# EAGLE design exia7th_v7 (EAGLE 9.6.2)
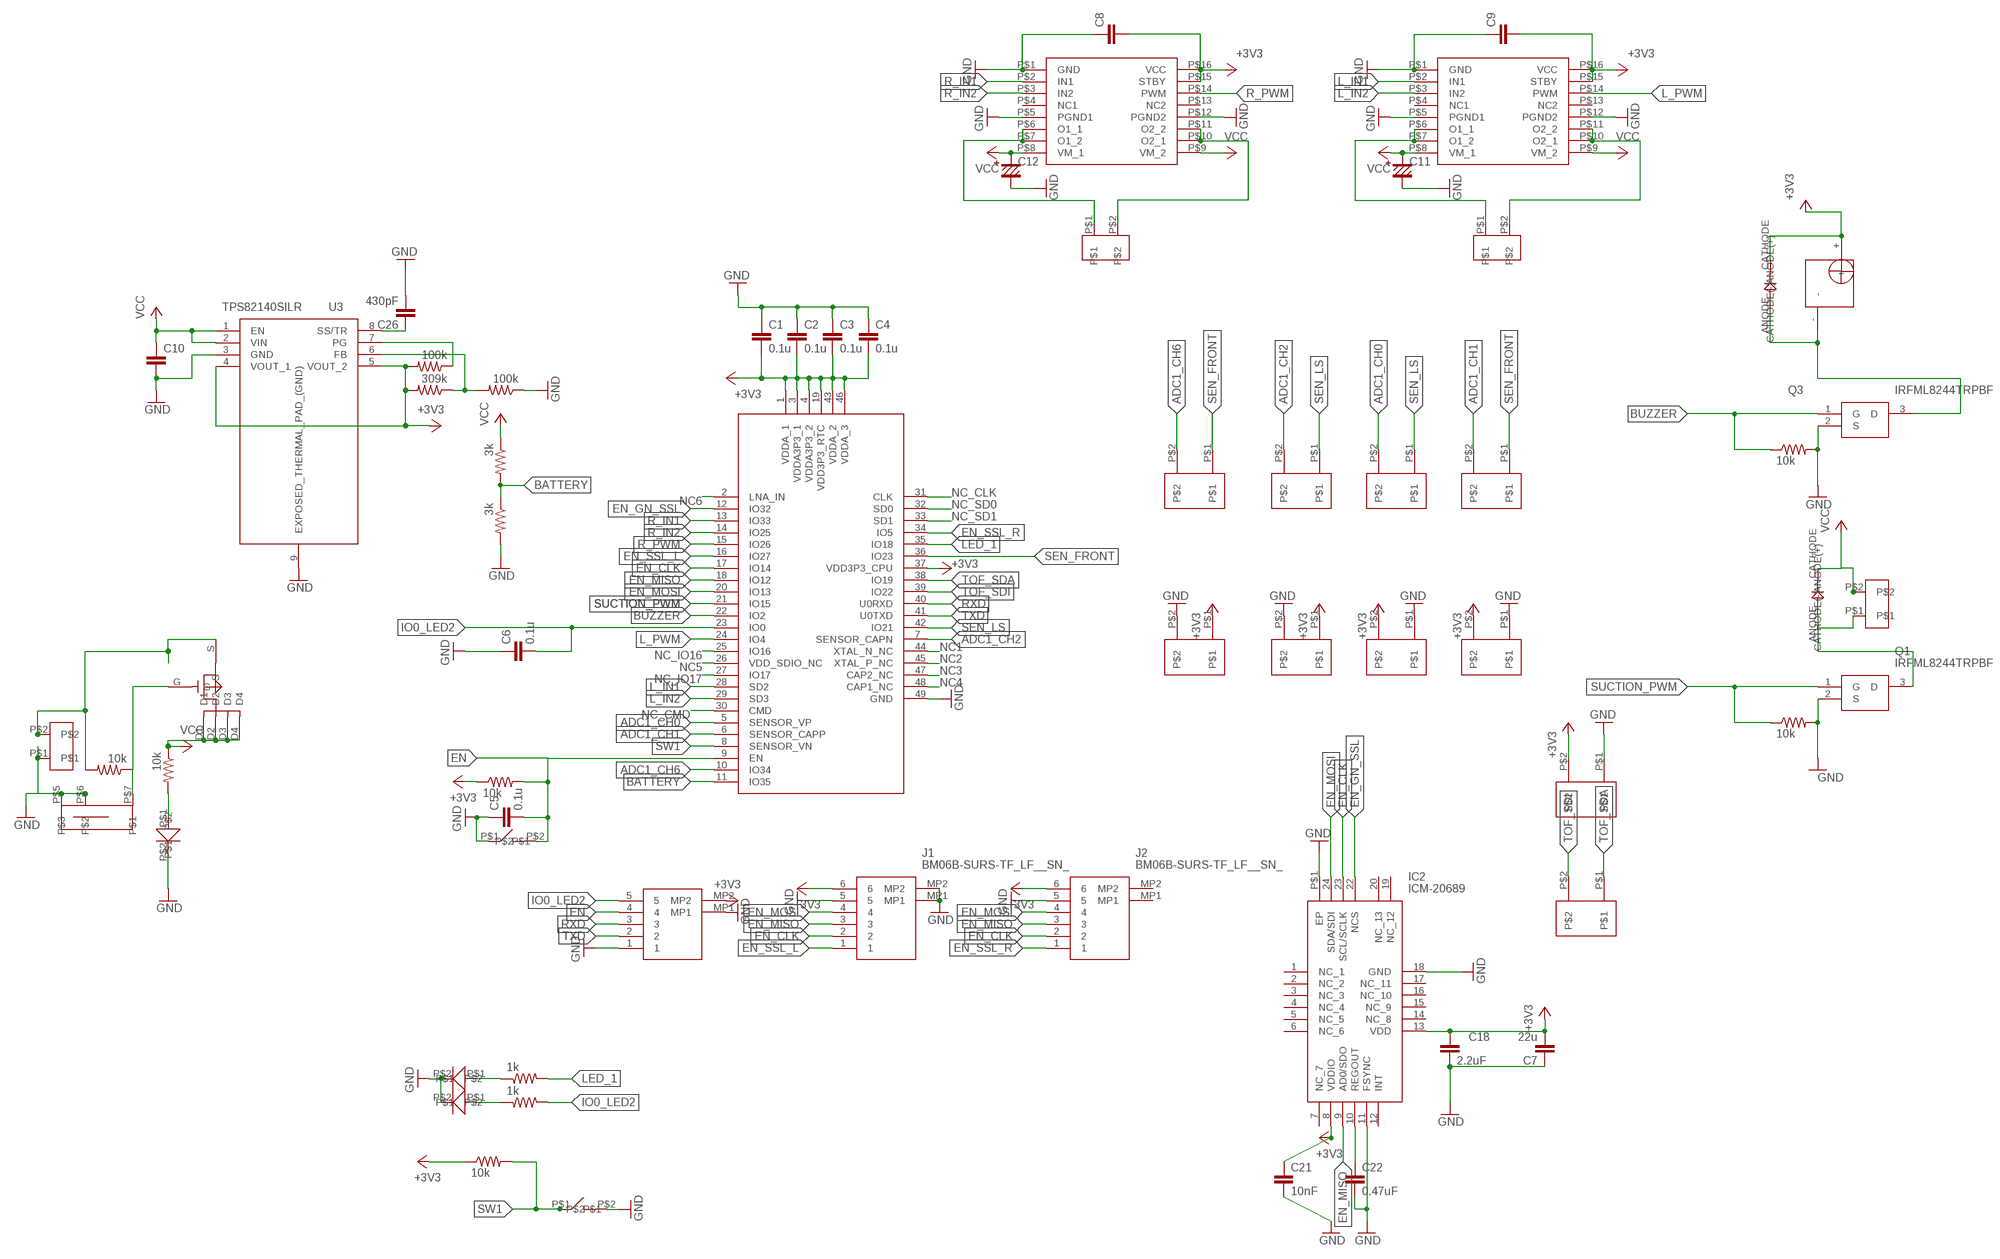
[diagram p0: schematic, sheet 1, part 1 of 2]
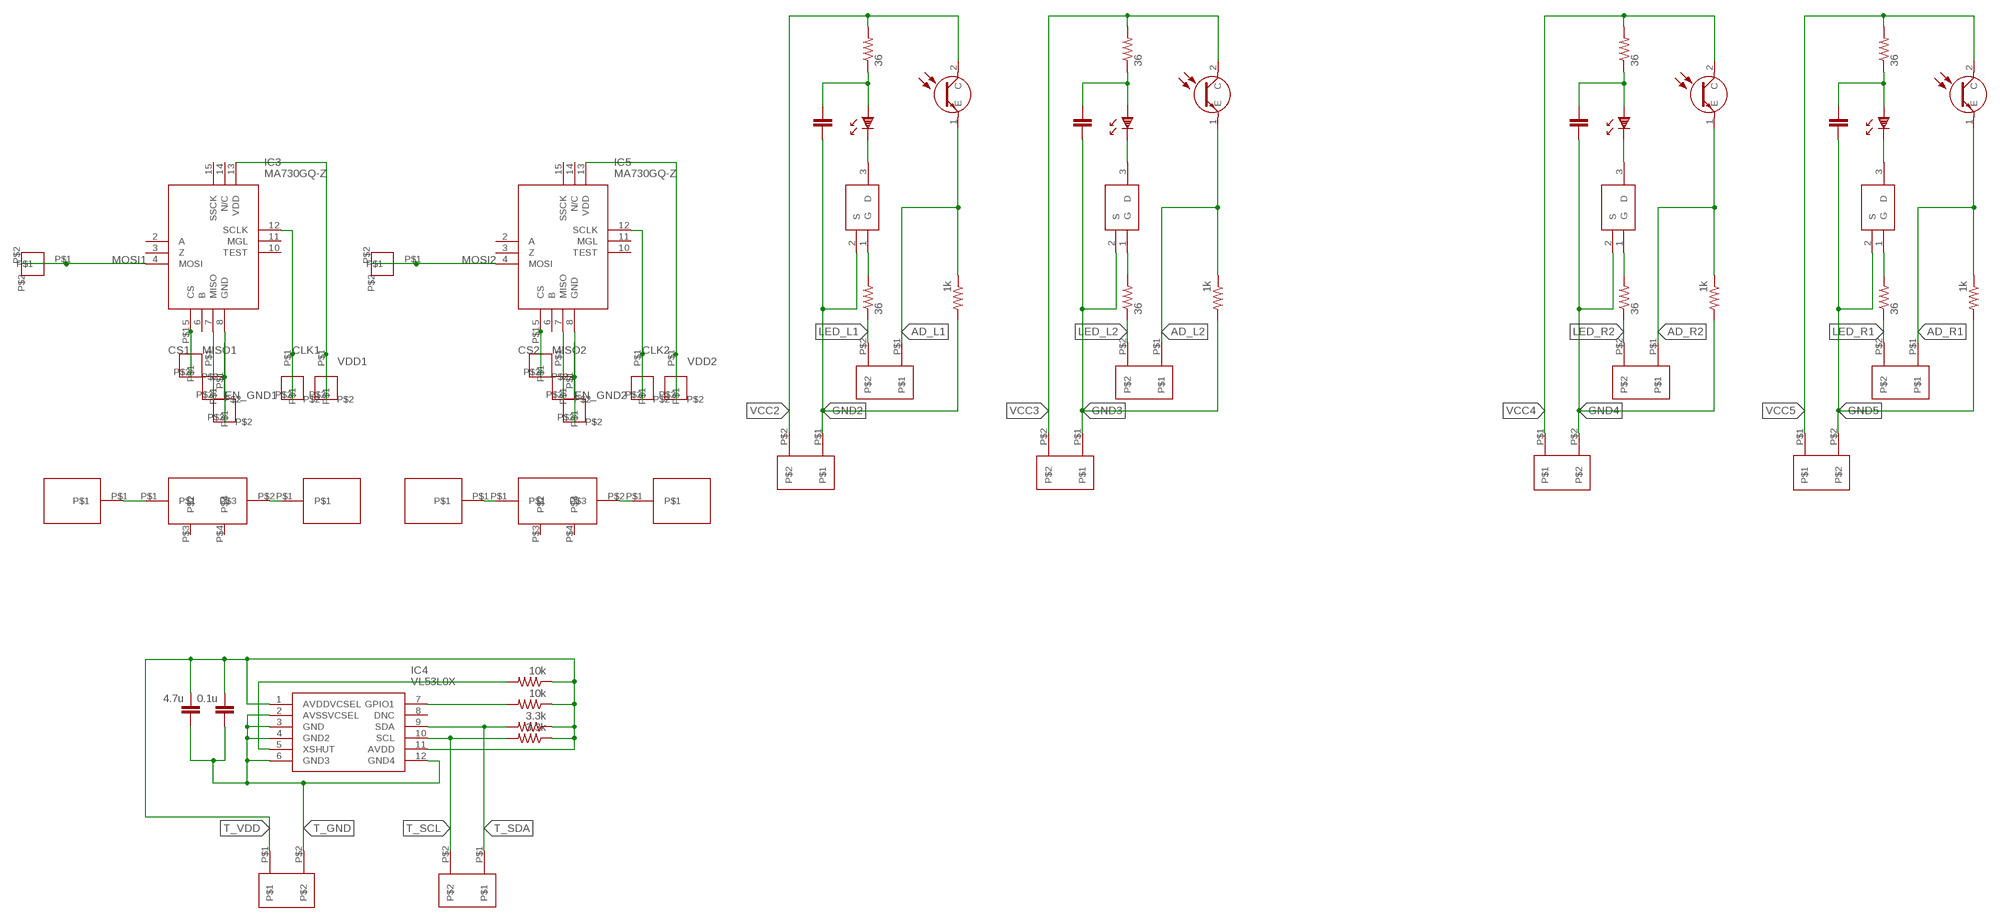
[diagram p1: schematic, sheet 1, part 2 of 2]

## Parts
C1  0.1u  C1005  [R1005]
C2  0.1u  C1005  [R1005]
C3  0.1u  C1005  [R1005]
C4  0.1u  C1005  [R1005]
C5  0.1u  C1005  [R1005]
C6  0.1u  C1005  [R1005]
C7  22u  C1608  [C1608]
C8  C1005  [R1005]
C9  C1005  [R1005]
C10  C1608  [C1608]
C11  EC1  [EC1]
C12  EC1  [EC1]
C13  C3216  [C3216]
C14  C3216  [C3216]
C15  C3216  [C3216]
C16  C3216  [C3216]
C17  0.1u  C1005  [R1005]
C18  2.2uF  C1005  [R1005]
C19  4.7u  C1005  [R1005]
C21  10nF  C1005  [R1005]
C22  0.47uF  C1005  [R1005]
C26  430pF  C1005  [R1005]
IC1  ESP32-PICO-D4  [ESP32-PICO-D4_1]
IC2  ICM-20689  [QFN50P400X400X95-25N]
IC3  MA730GQ-Z  [QFN50P300X300X100-17N]
IC4  VL53L0X  [VL53L0X]
IC5  MA730GQ-Z  [QFN50P300X300X100-17N]
J1  BM06B-SURS-TF_LF__SN_  [BM06BSURSTFLFSN]
J2  BM06B-SURS-TF_LF__SN_  [BM06BSURSTFLFSN]
J3  BM05B-SURS-TF  [BM05BSURSTF]
Q1  IRFML8244TRPBF  [SOT95P237X112-3N]
Q2  LTR-4206E  [LTR4206E]
Q3  IRFML8244TRPBF  [SOT95P237X112-3N]
Q4  IRFML8244TRPBF  [SOT95P237X112-3N]
Q5  LTR-4206E  [LTR4206E]
Q6  IRFML8244TRPBF  [SOT95P237X112-3N]
Q7  LTR-4206E  [LTR4206E]
Q8  IRFML8244TRPBF  [SOT95P237X112-3N]
Q9  LTR-4206E  [LTR4206E]
Q10  IRFML8244TRPBF  [SOT95P237X112-3N]
R1  10k  R1005  [R1005]
R2  3k  R1005  [R1005]
R3  3k  R1005  [R1005]
R4  10k  R1005  [R1005]
R5  36  R1005  [R1005]
R6  1k  R1005  [R1005]
R7  10k  R1005  [R1005]
R8  10k  R1005  [R1005]
R9  10k  R1005  [R1005]
R10  10k  R1005  [R1005]
R11  36  R1005  [R1005]
R12  36  R1005  [R1005]
R13  36  R1005  [R1005]
R14  1k  R1005  [R1005]
R15  36  R1005  [R1005]
R16  1k  R1005  [R1005]
R17  36  R1005  [R1005]
R18  36  R1005  [R1005]
R19  36  R1005  [R1005]
R20  3.3k  R1005  [R1005]
R21  3.3k  R1005  [R1005]
R22  10k  R1005  [R1005]
R23  1k  R1005  [R1005]
R24  1k  R1005  [R1005]
R25  100k  R1005  [R1005]
R26  10k  R1005  [R1005]
R28  309k  R1005  [R1005]
R36  100k  R1005  [R1005]
R54  1k  R1005  [R1005]
U3  TPS82140SILR  [SIL0008D]
U$1  TB6614  [TB6614]
U$2  LED_1005  [LED_1005]
U$3  CONNECTOR_15_2  [CONNECTOR_2]
U$4  DCX6  [DCX6]
U$5  SENSOR_FRONT1  [SENSOR_FRONT1]
U$6  SENSOR_FRONT1  [SENSOR_FRONT1]
U$7  SENSOR_FRONT1  [SENSOR_FRONT1]
U$8  SENSOR_FRONT1  [SENSOR_FRONT1]
U$9  SENSOR_FRONT1  [SENSOR_FRONT1]
U$10  SENSOR_FRONT1  [SENSOR_FRONT1]
U$11  SENSOR_FRONT1  [SENSOR_FRONT1]
U$12  DIODE  [DIODE]
U$13  BUZZER_44  [BUZZER]
U$14  CONNECTOR_15_2  [CONNECTOR_2]
U$15  DIODE  [DIODE]
U$16  DCX6  [DCX6]
U$17  CONNECTOR_15_2  [CONNECTOR_2]
U$18  CONNECTOR_15_2  [CONNECTOR_2]
U$19  TB6614  [TB6614]
U$20  SENSOR_FRONT1  [SENSOR_FRONT1]
U$21  SENSOR_FRONT1  [SENSOR_FRONT1]
U$22  TVAF06  [TVAF06]
U$23  SI3493  [MOS_FET_P]
U$24  ENCORDER_PAD  [ENCORDER_PAD]
U$25  LED_1005  [LED_1005]
U$26  LED_1005  [LED_1005]
U$27  ENCORDER_PAD  [ENCORDER_PAD]
U$28  ENCORDER_PAD  [ENCORDER_PAD]
U$29  ENCORDER_PAD  [ENCORDER_PAD]
U$30  ENCORDER_PAD  [ENCORDER_PAD]
U$31  ENCORDER_PAD  [ENCORDER_PAD]
U$32  SENSOR_FRONT1  [SENSOR_FRONT1]
U$33  SFH4550  [SFH_4550]
U$34  SENSOR_FRONT1  [SENSOR_FRONT1]
U$35  SENSOR_FRONT1  [SENSOR_FRONT1]
U$36  ENCORDER_PAD  [ENCORDER_PAD]
U$37  ENCORDER_PAD  [ENCORDER_PAD]
U$38  ENCORDER_PAD  [ENCORDER_PAD]
U$39  ENCORDER_PAD  [ENCORDER_PAD]
U$40  ENCORDER_PAD  [ENCORDER_PAD]
U$41  ENCORDER_PAD  [ENCORDER_PAD]
U$42  SFH4550  [SFH_4550]
U$43  TVAF06  [TVAF06]
U$44  SFH4550  [SFH_4550]
U$45  SENSOR_FRONT1  [SENSOR_FRONT1]
U$46  SENSOR_FRONT1  [SENSOR_FRONT1]
U$47  SFH4550  [SFH_4550]
U$48  SENSOR_FRONT1  [SENSOR_FRONT1]
U$49  SENSOR_FRONT1  [SENSOR_FRONT1]
U$50  SENSOR_FRONT1  [SENSOR_FRONT1]
U$51  SENSOR_FRONT1  [SENSOR_FRONT1]
U$52  PAD  [PAD]
U$53  SWICH  [SWITCH]
U$54  PAD  [PAD]
U$55  PAD  [PAD]
U$56  PAD  [PAD]
U$61  SENSOR_FRONT1  [SENSOR_FRONT1]
U$62  SENSOR_FRONT1  [SENSOR_FRONT1]

## Nets
+3V3: C1.P$2 C2.P$2 C3.P$2 C4.P$2 C7.2 C8.P$2 C9.P$2 C18.P$1 C21.P$1 IC1.1(VDDA_1) IC1.3(VDDA3P3_1) IC1.4(VDDA3P3_2) IC1.19(VDD3P3_RTC) IC1.37(VDD3P3_CPU) IC1.43(VDDA_2) IC1.46(VDDA_3) IC2.8(VDDIO) IC2.13(VDD) J1.6 J2.6 J3.MP2 R1.P$1 R8.P$1 R25.P$2 R28.P$2 U3.4(VOUT_1) U3.5(VOUT_2) U$1.P$15(STBY) U$1.P$16(VCC) U$7.P$1 U$10.P$2 U$11.P$2 U$13.+ U$15.CATHODE(CATHODE(-)) U$19.P$15(STBY) U$19.P$16(VCC) U$20.P$2 U$61.P$1
AD_L1: Q2.1(E) R54.P$1 U$62.P$1
AD_L2: Q5.1(E) R6.P$1 U$35.P$1
AD_R1: Q9.1(E) R16.P$1 U$49.P$1
AD_R2: Q7.1(E) R14.P$1 U$46.P$1
ADC1_CH0: IC1.5(SENSOR_VP) U$9.P$2
ADC1_CH1: IC1.6(SENSOR_CAPP) U$6.P$2
ADC1_CH2: IC1.7(SENSOR_CAPN) U$8.P$2
ADC1_CH6: IC1.10(IO34) U$5.P$2
BATTERY: IC1.11(IO35) R2.P$2 R3.P$1
BUZZER: IC1.22(IO2) Q3.1(G) R9.P$1
CLK1: IC3.12(SCLK) U$30.P$1 U$30.P$2
CLK2: IC5.12(SCLK) U$40.P$1 U$40.P$2
CS1: IC3.5(CS) U$27.P$1 U$27.P$2
CS2: IC5.5(CS) U$37.P$1 U$37.P$2
EN: C5.P$2 IC1.9(EN) J3.4 R1.P$2 U$22.P$2
EN_CLK: IC1.17(IO14) IC2.23(SCL/SCLK) J1.2 J2.2
EN_GN_SSL: IC1.12(IO32) IC2.22(NCS)
EN_GND1: IC3.8(GND) U$29.P$1 U$29.P$2
EN_GND2: IC5.8(GND) U$39.P$1 U$39.P$2
EN_MISO: IC1.18(IO12) IC2.9(AD0/SDO) J1.3 J2.3
EN_MOSI: IC1.20(IO13) IC2.24(SDA/SDI) J1.4 J2.4
EN_SSL_L: IC1.16(IO27) J1.1
EN_SSL_R: IC1.34(IO5) J2.1
GND: C1.P$1 C2.P$1 C3.P$1 C4.P$1 C5.P$1 C6.P$1 C7.1 C8.P$1 C9.P$1 C10.2 C11.2 C12.2 C18.P$2 C21.P$2 C22.P$2 C26.P$2 IC1.49(GND) IC2.11(FSYNC) IC2.18(GND) IC2.P$1(EP) J1.5 J1.MP1 J1.MP2 J2.5 J3.1 J3.MP1 Q1.2(S) Q3.2(S) R3.P$2 R9.P$2 R10.P$2 R36.P$1 U3.3(GND) U3.9(EXPOSED_THERMAL_PAD_(GND)) U$1.P$1(GND) U$1.P$5(PGND1) U$1.P$12(PGND2) U$2.P$2 U$3.P$1 U$7.P$2 U$10.P$1 U$11.P$1 U$19.P$1(GND) U$19.P$5(PGND1) U$19.P$12(PGND2) U$20.P$1 U$22.P$1 U$25.P$2 U$26.P$2 U$43.P$2 U$53.P$5 U$53.P$6 U$61.P$2
GND2: C13.2 Q4.2(S) R54.P$2 U$32.P$1
GND3: C14.2 Q6.2(S) R6.P$2 U$34.P$1
GND4: C15.2 Q8.2(S) R14.P$2 U$45.P$2
GND5: C16.2 Q10.2(S) R16.P$2 U$48.P$2
IO0_LED2: C6.P$2 IC1.23(IO0) J3.5 R23.P$2
L_IN1: IC1.28(SD2) U$1.P$2(IN1)
L_IN2: IC1.29(SD3) U$1.P$3(IN2)
L_PWM: IC1.24(IO4) U$1.P$14(PWM)
LED_1: IC1.35(IO18) R24.P$2
LED_L1: R5.P$1 U$62.P$2
LED_L2: R11.P$1 U$35.P$2
LED_R1: R17.P$1 U$49.P$2
LED_R2: R15.P$1 U$46.P$2
MISO1: IC3.7(MISO) U$28.P$1 U$28.P$2
MISO2: IC5.7(MISO) U$38.P$1 U$38.P$2
MOSI1: IC3.4(MOSI) U$24.P$1 U$24.P$2
MOSI2: IC5.4(MOSI) U$36.P$1 U$36.P$2
N$1: U$17.P$1 U$19.P$6(O1_1) U$19.P$7(O1_2)
N$2: U$17.P$2 U$19.P$10(O2_1) U$19.P$11(O2_2)
N$3: Q3.3(D) U$13.- U$15.ANODE(ANODE(+))
N$4: R4.P$2 U$2.P$1
N$5: C22.P$1 IC2.10(REGOUT)
N$6: Q4.3(D) U$44.CASODE(K)
N$7: Q4.1(G) R5.P$2
N$8: C14.1 R13.P$1 U$33.ANODE(A)
N$9: U$1.P$6(O1_1) U$1.P$7(O1_2) U$18.P$1
N$10: U$1.P$10(O2_1) U$1.P$11(O2_2) U$18.P$2
N$11: Q6.3(D) U$33.CASODE(K)
N$12: Q6.1(G) R11.P$2
N$13: C15.1 R18.P$1 U$42.ANODE(A)
N$14: Q8.3(D) U$42.CASODE(K)
N$15: R7.P$1 U$23.G U$53.P$7
N$16: Q8.1(G) R15.P$2
N$17: R7.P$2 U$3.P$2 U$23.S
N$18: C16.1 R19.P$1 U$47.ANODE(A)
N$19: Q10.3(D) U$47.CASODE(K)
N$20: Q10.1(G) R17.P$2
N$21: IC4.5(XSHUT) R22.P$2
N$22: IC4.7(GPIO1) R26.P$2
N$23: U$4.P$1 U$52.P$1
N$24: U$4.P$2 U$54.P$1
N$25: U$16.P$1 U$55.P$1
N$26: C26.P$1 U3.8(SS/TR)
N$27: U$16.P$2 U$56.P$1
N$28: R28.P$1 R36.P$2 U3.6(FB)
N$31: R25.P$1 U3.7(PG)
N$35: R23.P$1 U$26.P$1
N$36: R24.P$1 U$25.P$1
N$76: C13.1 R12.P$1 U$44.ANODE(A)
N$102: Q1.3(D) U$12.ANODE(ANODE(+)) U$14.P$1
NC1: IC1.44(XTAL_N_NC)
NC2: IC1.45(XTAL_P_NC)
NC3: IC1.47(CAP2_NC)
NC4: IC1.48(CAP1_NC)
NC5: IC1.26(VDD_SDIO_NC)
NC6: IC1.2(LNA_IN)
NC_CLK: IC1.31(CLK)
NC_CMD: IC1.30(CMD)
NC_IO16: IC1.25(IO16)
NC_IO17: IC1.27(IO17)
NC_SD0: IC1.32(SD0)
NC_SD1: IC1.33(SD1)
R_IN1: IC1.13(IO33) U$19.P$2(IN1)
R_IN2: IC1.14(IO25) U$19.P$3(IN2)
R_PWM: IC1.15(IO26) U$19.P$14(PWM)
RXD: IC1.40(U0RXD) J3.3
SEN_FRONT: IC1.36(IO23) U$5.P$1 U$6.P$1
SEN_LS: IC1.42(IO21) U$8.P$1 U$9.P$1
SUCTION_PWM: IC1.21(IO15) Q1.1(G) R10.P$1
SW1: IC1.8(SENSOR_VN) R8.P$2 U$43.P$1
T_GND: C17.P$1 C19.P$1 IC4.2(AVSSVCSEL) IC4.3(GND) IC4.4(GND2) IC4.6(GND3) IC4.12(GND4) U$50.P$2
T_SCL: IC4.10(SCL) R21.P$2 U$51.P$2
T_SDA: IC4.9(SDA) R20.P$2 U$51.P$1
T_VDD: C17.P$2 C19.P$2 IC4.1(AVDDVCSEL) IC4.11(AVDD) R20.P$1 R21.P$1 R22.P$1 R26.P$1 U$50.P$1
TOF_SDA: IC1.38(IO19) U$21.P$1
TOF_SDI: IC1.39(IO22) U$21.P$2
TXD: IC1.41(U0TXD) J3.2
VCC: C10.1 C11.1(PLUS) C12.1(PLUS) R2.P$1 R4.P$1 U3.1(EN) U3.2(VIN) U$1.P$8(VM_1) U$1.P$9(VM_2) U$12.CATHODE(CATHODE(-)) U$14.P$2 U$19.P$8(VM_1) U$19.P$9(VM_2) U$23.D1 U$23.D2 U$23.D3 U$23.D4
VCC2: Q2.2(C) R12.P$2 U$32.P$2
VCC3: Q5.2(C) R13.P$2 U$34.P$2
VCC4: Q7.2(C) R18.P$2 U$45.P$1
VCC5: Q9.2(C) R19.P$2 U$48.P$1
VDD1: IC3.13(VDD) U$31.P$1 U$31.P$2
VDD2: IC5.13(VDD) U$41.P$1 U$41.P$2
Unconnected: IC2.1(NC_1) IC2.2(NC_2) IC2.3(NC_3) IC2.4(NC_4) IC2.5(NC_5) IC2.6(NC_6) IC2.7(NC_7) IC2.12(INT) IC2.14(NC_8) IC2.15(NC_9) IC2.16(NC_10) IC2.17(NC_11) IC2.19(NC_12) IC2.20(NC_13) IC3.2(A) IC3.3(Z) IC3.6(B) IC3.10(TEST) IC3.11(MGL) IC3.14(N/C) IC3.15(SSCK) IC4.8(DNC) IC5.2(A) IC5.3(Z) IC5.6(B) IC5.10(TEST) IC5.11(MGL) IC5.14(N/C) IC5.15(SSCK) J2.MP1 J2.MP2 U$1.P$4(NC1) U$1.P$13(NC2) U$4.P$3 U$4.P$4 U$16.P$3 U$16.P$4 U$19.P$4(NC1) U$19.P$13(NC2)

## Library data of the parts
C1-C6 C8 C9 C17-C19 C21 C22 C26 = Capacitor:C1005
C7 C10 = Capacitor:C1608
C11 C12 = Capacitor:EC: Electrolytic Capacitor
C13-C16 = Capacitor:C3216
IC1 = ESP32-PICO-D4:ESP32-PICO-D4: ESP32-PICO-D4 module Source: Datasheet <http://www.espressif.com/sites/default/files/documentation/esp32-pico-d4_datasheet_en.pdf>; DESCRIPTION: ESP32-PICO-D4 module; HEIGHT: mm; MANUFACTURER_NAME: Espressif Systems; MANUFACTURER_PART_NUMBER: ESP32-PICO-D4; MOUSER_PART_NUMBER: 356-ESP32-PICO-D4; MOUSER_PRICE-STOCK: https://www.mouser.co.uk/ProductDetail/Espressif-Systems/ESP32-PICO-D4/?qs=MLItCLRbWsw7MJlbN3HfdA%3D%3D
IC2 = ICM-20689-org:ICM-20689: IMUs - Inertial Measurement Units 6-Axis DMP-Enabled Drone/VR/IoT solution, Targeted For All Current MPU-6000/6050 Users Source: Datasheet <https://www.invensense.com/wp-content/uploads/2016/03/PB-000045-ICM-20689-v1.0.pdf>; DESCRIPTION: IMUs - Inertial Measurement Units 6-Axis DMP-Enabled Drone/VR/IoT solution, Targeted For All Current MPU-6000/6050 Users; HEIGHT: 0.95mm; MANUFACTURER_NAME: TDK; MANUFACTURER_PART_NUMBER: ICM-20689
IC3 IC5 = MA730GQ-Z-org:MA730GQ-Z: Board Mount Hall Effect / Magnetic Sensors 14-bit, digital, contactless angle sensor with ABZ incremental and PWM output Source: Datasheet <https://www.monolithicpower.com/pub/media/document/m/a/ma730_r1.01.pdf>; DESCRIPTION: Board Mount Hall Effect / Magnetic Sensors 14-bit, digital, contactless angle sensor with ABZ incremental and PWM output; HEIGHT: 1mm; MANUFACTURER_NAME: Monolithic Power Systems (MPS); MANUFACTURER_PART_NUMBER: MA730GQ-Z
IC4 = VL53L0X:VL53L0X: World smallest Time-of-Flight ranging and gesture detection sensor Source: Datasheet; DESCRIPTION: World smallest Time-of-Flight ranging and gesture detection sensor; HEIGHT: 1mm; MANUFACTURER_NAME: STMicroelectronics; MANUFACTURER_PART_NUMBER: VL53L0X
J1 J2 = BM06B-SURS-TF_LF__SN_:BM06B-SURS-TF_LF__SN_: CONN HEADER SMD 6POS 0.8MM Source: Datasheet <http://www.jst-mfg.com/product/pdf/eng/eSUR.pdf>; DESCRIPTION: CONN HEADER SMD 6POS 0.8MM; HEIGHT: 2.7mm; MANUFACTURER_NAME: JST (JAPAN SOLDERLESS TERMINALS); MANUFACTURER_PART_NUMBER: BM06B-SURS-TF(LF)(SN)
J3 = BM05B-SURS-TF:BM05B-SURS-TF: 0.8mm pitch connector. Source: Datasheet <http://www.jst-mfg.com/product/pdf/jpn/SUH.pdf>; DESCRIPTION: 0.8mm pitch connector.; HEIGHT: 2.7mm; MANUFACTURER_NAME: JST (JAPAN SOLDERLESS TERMINALS); MANUFACTURER_PART_NUMBER: BM05B-SURS-TF
Q1 Q3 Q4 Q6 Q8 Q10 = IRFML8244TRPBF:IRFML8244TRPBF: MOSFET MOSFT 25V 5.8A 24mOhm 5.4 Qg Source: Datasheet <http://uk.rs-online.com/web/p/products/7377219P>; ALLIED_NUMBER: 70411466; DESCRIPTION: MOSFET MOSFT 25V 5.8A 24mOhm 5.4 Qg; HEIGHT: 1.12mm; MANUFACTURER_NAME: Infineon; MANUFACTURER_PART_NUMBER: IRFML8244TRPBF; RS_PART_NUMBER: 7377219P; RS_PRICE-STOCK: http://uk.rs-online.com/web/p/products/7377219P
Q2 Q5 Q7 Q9 = LTR-4206E:LTR-4206E: Phototransistors Phototrans Filtered Source: Datasheet <http://optoelectronics.liteon.com/upload/download/DS-50-92-0073/R4206E.pdf>; DESCRIPTION: Phototransistors Phototrans Filtered; HEIGHT: 6.65mm; MANUFACTURER_NAME: Lite-On; MANUFACTURER_PART_NUMBER: LTR-4206E; MOUSER_PART_NUMBER: 859-LTR-4206E; MOUSER_PRICE-STOCK: https://www.mouser.com/Search/Refine.aspx?Keyword=859-LTR-4206E
R1-R26 R28 R36 R54 = Resistor:R1005
U3 = TPS82140SILR:TPS82140SILR: Non-Isolated DC/DC Converters 17V Input 2A Synchronous Step-Down Converter Module With Integrated MicroSiP 8-uSiP -40 to 125 Source: Datasheet <http://www.ti.com/lit/ds/symlink/tps82140.pdf>; DESCRIPTION: Non-Isolated DC/DC Converters 17V Input 2A Synchronous Step-Down Converter Module With Integrated MicroSiP 8-uSiP -40 to 125; HEIGHT: mm; MANUFACTURER_NAME: Texas Instruments; MANUFACTURER_PART_NUMBER: TPS82140SILR; MOUSER_PART_NUMBER: 595-TPS82140SILR; MOUSER_PRICE-STOCK: https://www.mouser.com/Search/Refine.aspx?Keyword=595-TPS82140SILR
U$1 U$19 = SSOP16:TB6614
U$2 U$25 U$26 = led_1005:LED_1005
U$3 U$14 U$17 U$18 = connector_15_2:CONNECTOR_15_2
U$4 U$16 = dcx6:DCX6
U$5-U$11 U$20 U$21 U$32 U$34 U$35 U$45 U$46 U$48-U$51 U$61 U$62 = sensor_side:SENSOR_FRONT1
U$12 U$15 = diode:DIODE
U$13 = buzzer_4_4:BUZZER_4*4
U$22 U$43 = tvaf06_tack_switch:TVAF06
U$23 = mos_fet_p:SI3493
U$24 U$27-U$31 U$36-U$41 = encorder_via:ENCORDER_PAD
U$33 U$42 U$44 U$47 = LED:SFH4550
U$52 U$54-U$56 = pad:PAD
U$53 = switch:SWICH

## Module DD
Ports: 

### Library data of the parts

## Board
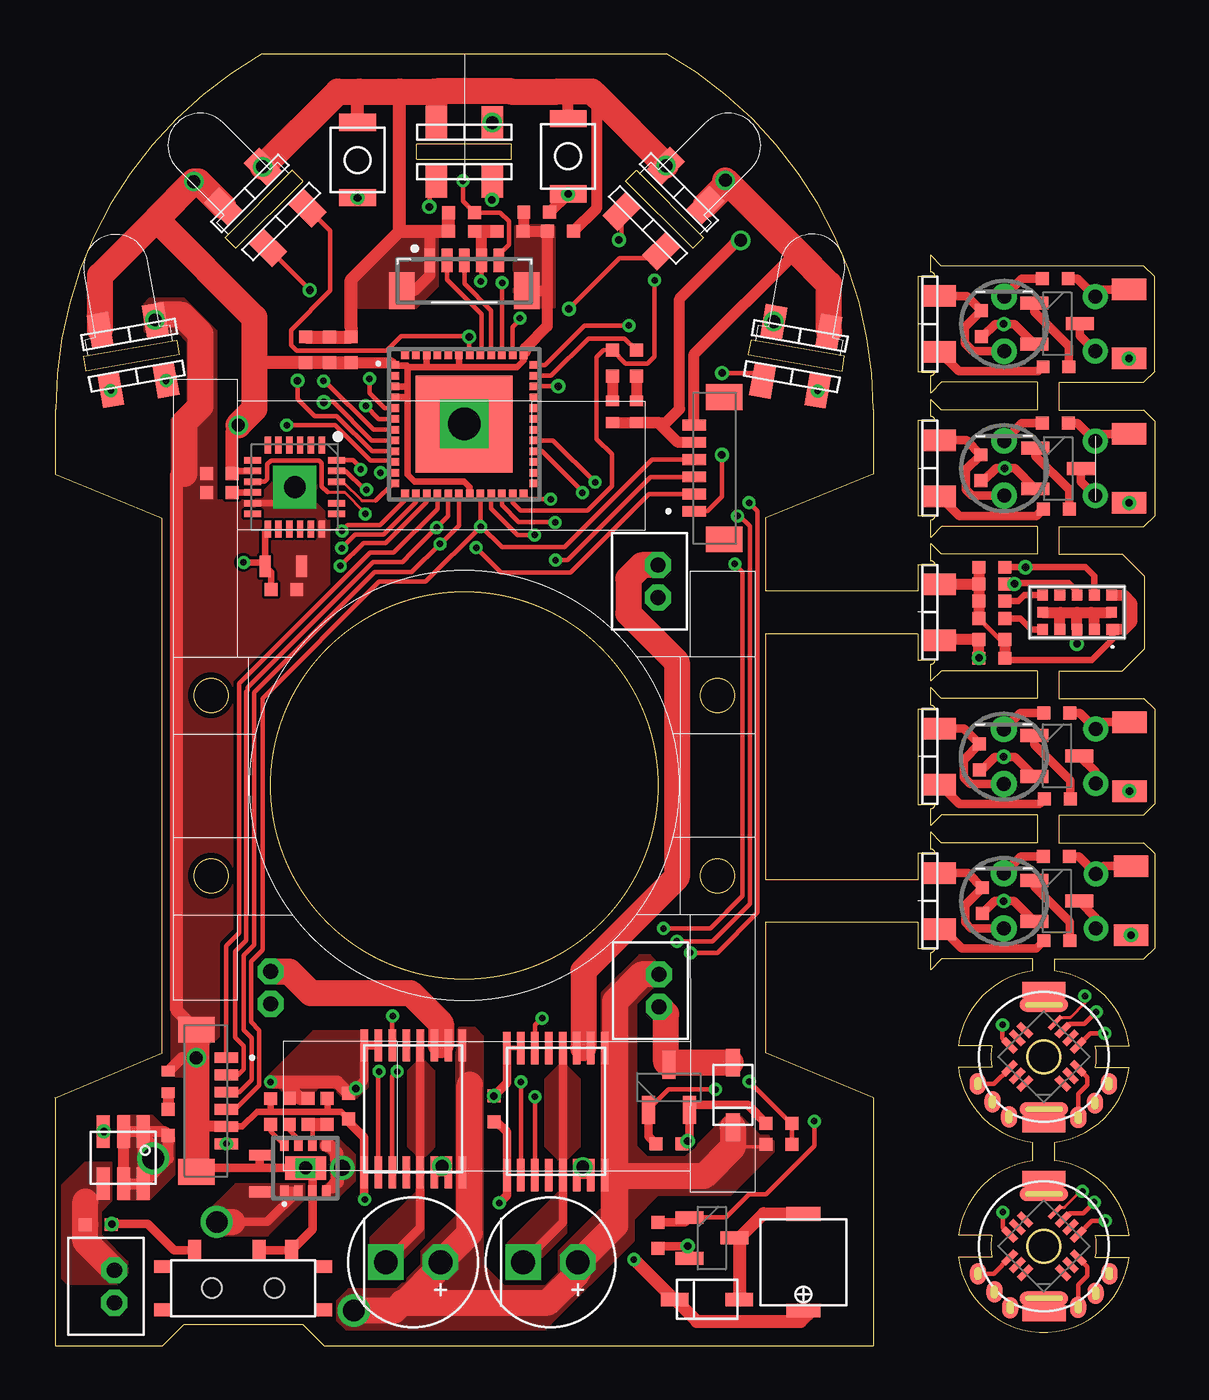
[diagram p2: board, top side]
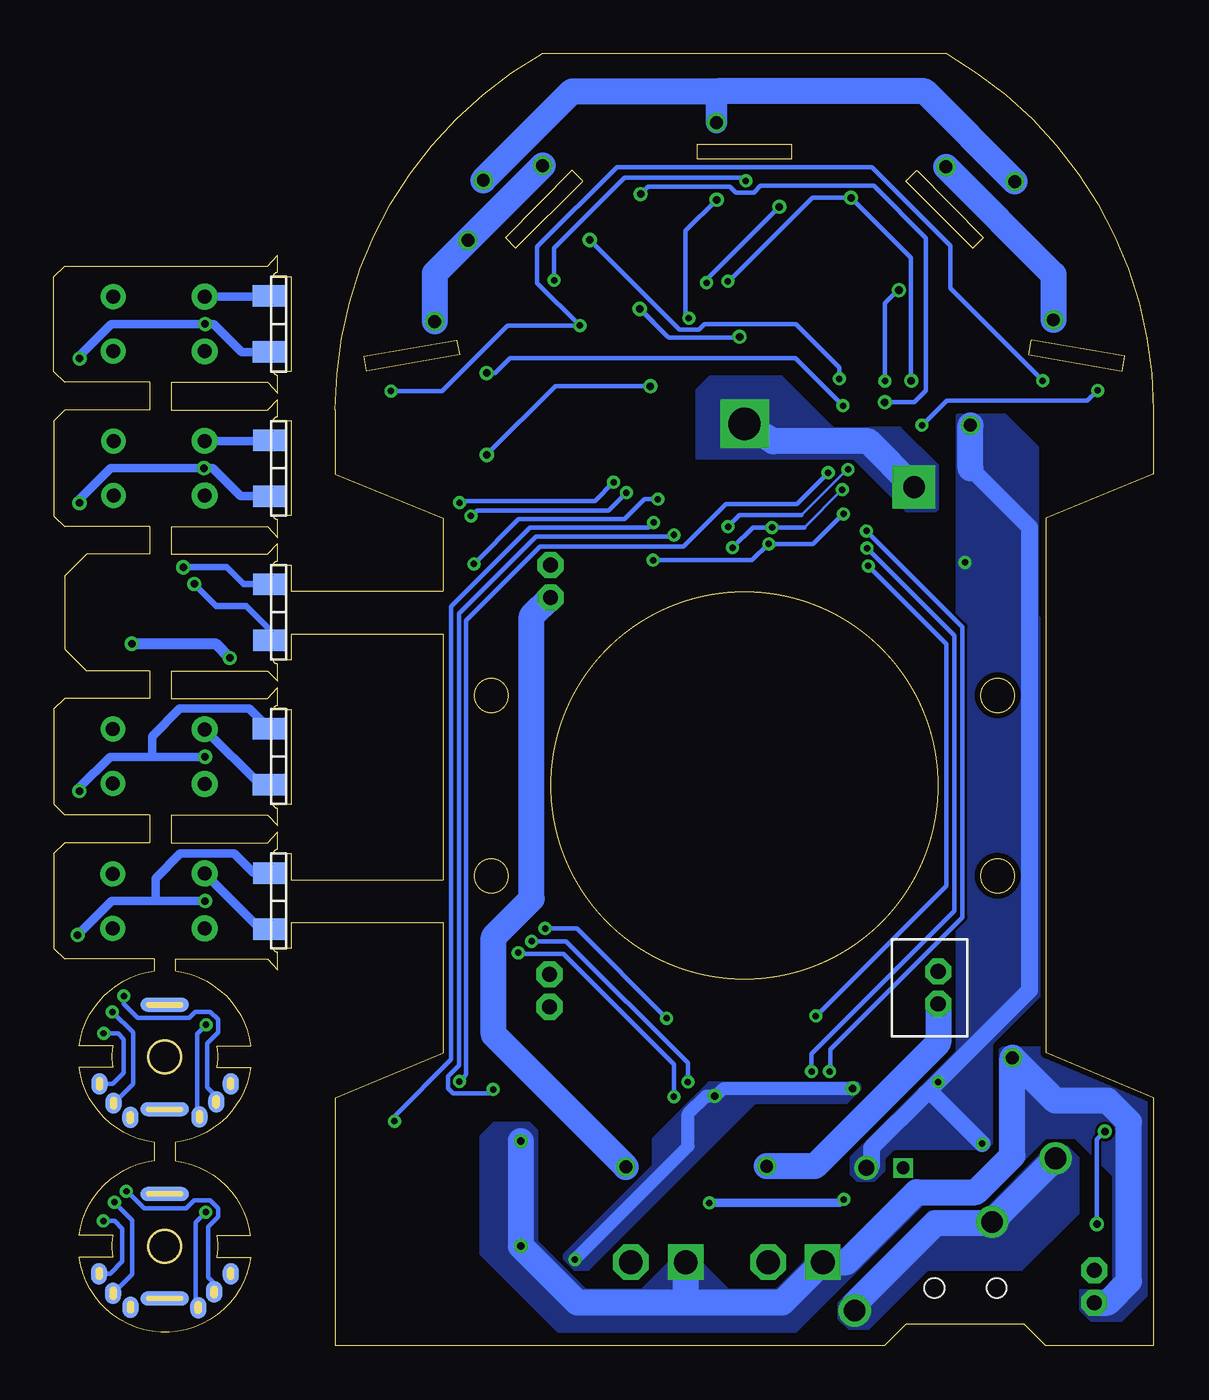
[diagram p3: board, bottom side, seen from below]

Size 51.07 x 60 mm. Coordinates in mm from the lower left corner, seen from the top.
Outline: 40.66,23.04 40.66,23.06
Outline: 40.66,23.06 40.66,23.85 41.15,23.34 45.62,23.34 45.62,24.64 41.15,24.64 40.66,24.16 40.66,24.94 arc90 40.87,25.15 40.06,25.15 40.06,29.54 40.87,29.54 arc90 40.66,29.74 40.66,30.56 41.15,30.05 45.62,30.05 45.62,31.34 41.15,31.34 40.66,30.86 40.66,31.65 arc90 40.87,31.85 40.06,31.85 40.06,33.05 32.99,33.05 32.99,21.64 40.06,21.64 40.06,22.86 40.87,22.86 arc90 40.66,23.06
Outline: 40.86,18.44 arc-86 40.66,18.26 40.66,17.45 41.15,17.96 45.41,17.96 45.41,17.4 arc76 41.94,13.92 43.51,13.92 arc23 43.51,12.93 41.94,12.93 arc76 45.41,9.45 45.41,8.59 arc76 41.95,5.13
Outline: 40.87,18.44 40.06,18.44 40.06,19.66 32.99,19.66 32.99,13.59 38,11.51 38,0 12.5,0 11.5,1 6,1 5,0 0,0 0,11.51
Outline: 40.86,45.24 arc-86 40.66,45.06 40.66,44.25 41.15,44.76 45.62,44.76 45.62,43.46 41.15,43.46 40.66,43.94 40.66,43.16 arc-90 40.87,42.95 40.06,42.95 40.06,38.56 40.87,38.56 arc-90 40.66,38.35 40.66,37.54 41.15,38.05 45.62,38.05 45.62,36.75 41.15,36.75 40.66,37.26 40.66,36.45 arc-90 40.87,36.25 40.06,36.25 40.06,35.05 32.99,35.05 32.99,38.43 38,40.49 38,43.48 arc60 28.4,60
Outline: 40.87,45.24 40.06,45.24 40.06,49.66 40.87,49.66 arc90 40.66,49.86 40.66,50.65 41.15,50.14 50.55,50.14 51.07,49.65 51.07,45.24 50.55,44.76 46.61,44.76 46.61,43.46 50.55,43.46 51.07,42.94 51.07,38.54 50.55,38.05 46.61,38.05 46.61,36.75 49.55,36.75 50.57,35.74 50.57,32.36 49.55,31.34 46.61,31.34 46.61,30.05 50.55,30.05 51.07,29.56 51.07,25.15 50.55,24.64 46.61,24.64 46.61,23.34 50.55,23.34 51.07,22.85 51.07,18.45 50.55,17.96 46.41,17.96 46.41,17.4 arc-76 49.89,13.92 48.31,13.92 arc-23 48.31,12.93 49.89,12.93 arc-76 46.41,9.45 46.41,8.59
Outline: 46.41,8.6 arc-76 49.89,5.13 48.31,5.13 arc-24 48.31,4.12 49.89,4.12 arc-165 41.94,4.12 43.51,4.12 arc-24 43.51,5.13 41.94,5.13
Outline: 0,11.51 0,11.53
Outline: 0,11.51 4.98,13.59 4.98,38.43 0,40.49 0,43.48
Outline: 0.01,43.48 arc-60 9.6,59.99 28.4,59.99
Outline: 21.18,55.79 16.79,55.79 16.79,55.1 21.18,55.1 21.18,55.79
Outline: 27,54.59 30.1,51.46 29.62,50.98 26.49,54.08 27,54.59
Outline: 11,54.59 7.9,51.46 8.38,50.98 11.51,54.08 11,54.59
Outline: 36.65,45.95 32.33,46.71 32.21,46.02 36.55,45.26 36.65,45.95
Outline: 1.32,45.95 5.66,46.71 5.79,46.02 1.45,45.26 1.32,45.95
Outline: circle at 7.24,21.82 radius 0.79
Outline: circle at 7.24,30.2 radius 0.79
Outline: circle at 19,26.01 radius 8.99
Outline: circle at 30.76,30.2 radius 0.79
Outline: circle at 30.76,21.82 radius 0.79
Copper layers (1*16): Top 0.035mm / dielectric 1.5mm / Bottom 0.035mm
Design rules "original_exia4 *": minimum track width 5mil, minimum drill 0.25mm, track to track 5mil, track to pad 5mil, pad to pad 5mil, via to via 5mil, smd to smd 0mil, copper to edge 10mil, drill to drill 10mil, minimum pad ring 10mil, minimum via ring 6mil, stop-mask expansion 2mil, vias tented up to drill 100mil, thermal gap 0mil

### Footprints (pad centres in the part's own frame; a part is rotated, then mirrored left to right if it is on the bottom)
R1005 = smd 0.6 x 0.6: P$1 -0.6,0; P$2 0.6,0
C1608 = smd 0.5 x 1: 1 -0.85,0; 2 0.85,0
EC1 = drill 1.1 octagon: 1 -1.27,0 | drill 1.1 square: 2 1.27,0
C3216 = smd 1 x 1.6: 1 -1.6,0; 2 1.6,0
ESP32-PICO-D4_1 = smd 0.55 x 0.35: 1 -3.3,2.75; 2 -3.3,2.25; 3 -3.3,1.75; 4 -3.3,1.25; 5 -3.3,0.75; 6 -3.3,0.25; 7 -3.3,-0.25; 8 -3.3,-0.75; 9 -3.3,-1.25; 10 -3.3,-1.75; 11 -3.3,-2.25; 12 -3.3,-2.75; 25 3.3,-2.75; 26 3.3,-2.25; 27 3.3,-1.75; 28 3.3,-1.25; 29 3.3,-0.75; 30 3.3,-0.25; 31 3.3,0.25; 32 3.3,0.75; 33 3.3,1.25; 34 3.3,1.75; 35 3.3,2.25; 36 3.3,2.75 | smd 0.35 x 0.55: 13 -2.75,-3.3; 14 -2.25,-3.3; 15 -1.75,-3.3; 16 -1.25,-3.3; 17 -0.75,-3.3; 18 -0.25,-3.3; 19 0.25,-3.3; 20 0.75,-3.3; 21 1.25,-3.3; 22 1.75,-3.3; 23 2.25,-3.3; 24 2.75,-3.3; 37 2.75,3.3; 38 2.25,3.3; 39 1.75,3.3; 40 1.25,3.3; 41 0.75,3.3; 42 0.25,3.3; 43 -0.25,3.3; 44 -0.75,3.3; 45 -1.25,3.3; 46 -1.75,3.3; 47 -2.25,3.3; 48 -2.75,3.3 | smd 4.5 x 4.5: 49 -0.006,0.013
QFN50P400X400X95-25N = smd 0.8 x 0.3: 1 -1.95,1.25; 2 -1.95,0.75; 3 -1.95,0.25; 4 -1.95,-0.25; 5 -1.95,-0.75; 6 -1.95,-1.25; 13 1.95,-1.25; 14 1.95,-0.75; 15 1.95,-0.25; 16 1.95,0.25; 17 1.95,0.75; 18 1.95,1.25 | smd 0.3 x 0.8: 7 -1.25,-1.95; 8 -0.75,-1.95; 9 -0.25,-1.95; 10 0.25,-1.95; 11 0.75,-1.95; 12 1.25,-1.95; 19 1.25,1.95; 20 0.75,1.95; 22 -0.25,1.95; 23 -0.75,1.95; 24 -1.25,1.95 | drill 1 pad 2 square: P$1 0,0
QFN50P300X300X100-17N = smd 0.8 x 0.3: 2 -1.5,0.25; 3 -1.5,-0.25; 4 -1.5,-0.75; 10 1.5,-0.25; 11 1.5,0.25; 12 1.5,0.75 | smd 0.3 x 0.8: 5 -0.75,-1.5; 6 -0.25,-1.5; 7 0.25,-1.5; 13 0.75,1.5; 14 0.25,1.5; 15 -0.25,1.5 | smd 0.2 x 0.8: 8 0.75,-1.5
VL53L0X = smd 0.58 x 0.5: 1 1.64,-0.575 | smd 0.5 x 0.5: 2 0.8,-0.575; 3 0,-0.575; 4 -0.8,-0.575; 5 -1.6,-0.575; 6 -1.6,0.225; 7 -1.6,1.025; 8 -0.8,1.025; 9 0,1.025; 10 0.8,1.025; 11 1.6,1.025; 12 1.6,0.225
BM06BSURSTFLFSN = smd 0.5 x 1.1: 1 2,-0.95; 2 1.2,-0.95; 3 0.4,-0.95; 4 -0.4,-0.95; 5 -1.2,-0.95; 6 -2,-0.95 | smd 1.2 x 1.7: MP1 3.3,0.45; MP2 -3.3,0.45
BM05BSURSTF = smd 0.5 x 1.1: 1 1.6,-1.4; 2 0.8,-1.4; 3 0,-1.4; 4 -0.8,-1.4; 5 -1.6,-1.4 | smd 1.2 x 1.7: MP1 2.9,0; MP2 -2.9,0
SOT95P237X112-3N = smd 1.3 x 0.6: 1 -1.05,0.95; 2 -1.05,-0.95; 3 1.05,0
LTR4206E = drill 0.65 pad 1.2: 1 -1.27,0; 2 1.27,0
R1005' = smd 0.6 x 0.6: P$1 -0.602,0; P$2 0.602,0
SIL0008D = smd 0.5 x 0.4: 1 -1.05,0.975; 2 -1.05,0.325; 3 -1.05,-0.325; 4 -1.05,-0.975; 5 1.05,-0.975; 6 1.05,-0.325; 7 1.05,0.325; 8 1.05,0.975 | smd 1.1 x 1.9: 9 0,0
TB6614 = smd 0.35 x 1.5: P$1 -2.275,-2.95; P$2 -1.625,-2.95; P$3 -0.975,-2.95; P$4 -0.325,-2.95; P$5 0.325,-2.95; P$6 0.975,-2.95; P$7 1.625,-2.95; P$8 2.275,-2.95; P$9 2.275,2.95; P$10 1.625,2.95; P$11 0.975,2.95; P$12 0.325,2.95; P$13 -0.325,2.95; P$14 -0.975,2.95; P$15 -1.625,2.95; P$16 -2.275,2.95
LED_1005 = smd 0.5 x 0.6: P$1 -0.5,0; P$2 0.5,0
CONNECTOR_2 = drill 0.7 octagon: P$1 -0.75,0; P$2 0.75,0
DCX6 = smd 0.65 x 2.25: P$1 -2.425,0; P$2 2.425,0 | smd 0.65 x 2.25 bottom: P$3 -2.425,0; P$4 2.425,0
SENSOR_FRONT1 = smd 1 x 1.5: P$1 -1.3,0.8; P$2 1.3,0.8
DIODE = smd 1.27 x 0.635: ANODE 2.9,0.9; CATHODE -0.1,0.9
BUZZER = smd 0.635 x 1.6: + 4.25,2; - -0.25,2
TVAF06 = smd 1.7 x 0.8: P$1 1.45,3.25; P$2 1.45,-0.25
MOS_FET_P = smd 1.5 x 0.6: D1 -1.2,0.9; D2 -1.2,0; D3 1.225,0; D4 1.225,0.9; G -1.2,-0.95; S 1.225,-0.95
ENCORDER_PAD = smd 0.75 x 1: P$1 0,0 | smd 0.75 x 1 bottom: P$2 0,0
SFH_4550 = drill 0.65: ANODE -1.27,0; CASODE 1.27,0
PAD = smd 0.75 x 2: P$1 0,0
SWITCH = smd 0.75 x 0.6: P$1 -0.4,0.3; P$2 -0.4,2.3; P$3 7.1,0.3; P$4 7.1,2.3 | smd 0.6 x 1: P$5 5.6,3.05; P$6 4.1,3.05; P$7 1.1,3.05 | hole 0.9: 1.9,1.3; 4.8,1.3

### Placement (x,y rotation side)
C1  13.75,46.25 270 top
C2  11.62,46.25 270 top
C3  12.75,46.25 270 top
C4  23.47,51.76 180 top
C5  18.88,51.75 0 top
C6  18.88,52.62 0 top
C7  10.6,36.2 180 top
C8  13.62,11.12 90 top
C9  20.38,11 90 top
C10  9.5,8 90 top
C11  16.62,3.88 180 top
C12  23,3.88 180 top
C13  49.88,40.74 270 top
C14  49.87,47.45 270 top
C15  49.89,27.36 270 top
C16  49.97,20.67 270 top
C17  43.5,32.79 0 top
C18  10.62,35.12 0 top
C19  43.5,31.93 0 top
C21  7.62,40.5 180 top
C22  7.62,39.62 180 top
C26  10,10.88 90 top
IC1  19,42.79 0 top
IC2  11.12,39.88 270 top
IC3  45.92,13.41 135 top
IC4  47.46,33.83 0 top
IC5  45.92,4.62 135 top
J1  7,11.38 90 top
J2  30.62,40.75 270 top
J3  19,49 180 top
Q1  28.5,12 90 top
Q2  44.07,40.75 90 top
Q3  30.5,5 0 top
Q4  46.58,40.74 0 top
Q5  44.07,47.45 90 top
Q6  46.53,47.46 0 top
Q7  44.06,27.36 90 top
Q8  46.52,27.39 0 top
Q9  44.06,20.65 90 top
Q10  46.52,20.65 0 top
R1  10k  [R1005']  21.12,51.75 180 top
R2  3k  [R1005']  33.61,9.34 0 top
R3  3k  [R1005']  33.61,10.33 180 top
R4  10k  [R1005']  5.25,10.38 90 top
R5  36  [R1005']  46.49,38.85 0 top
R6  1k  [R1005']  43.02,47.46 270 top
R7  10k  [R1005']  2,5.62 180 top
R8  10k  [R1005']  22.36,52.64 0 top
R9  10k  [R1005']  28,5.12 270 top
R10  10k  [R1005']  28.5,9.38 0 top
R11  36  [R1005']  46.48,45.46 0 top
R12  36  [R1005']  46.45,42.84 180 top
R13  36  [R1005']  46.44,49.55 180 top
R14  1k  [R1005']  42.93,27.34 270 top
R15  36  [R1005']  46.54,25.39 0 top
R16  1k  [R1005']  43.06,20.67 270 top
R17  36  [R1005']  46.53,18.81 0 top
R18  36  [R1005']  46.51,29.38 180 top
R19  36  [R1005']  46.49,22.72 180 top
R20  3.3k  [R1005']  43.5,35.38 0 top
R21  3.3k  [R1005']  43.5,36.15 0 top
R22  10k  [R1005']  43.5,33.77 0 top
R23  1k  [R1005']  25.88,45.62 90 top
R24  1k  [R1005']  27,45.62 90 top
R25  100k  [R1005']  10.88,10.88 90 top
R26  10k  [R1005']  43.5,34.58 0 top
R28  309k  [R1005']  11.75,10.88 90 top
R36  100k  [R1005']  12.62,10.88 270 top
R54  1k  [R1005']  42.99,40.77 270 top
U3  11.62,8.25 90 top
U$1  23.25,10.88 0 top
U$2  5.25,12.25 90 top
U$3  2.75,2.75 90 top
U$4  45.92,4.62 90 top
U$5  3.73,45.37 190 top
U$6  34.27,45.35 170 top
U$7  9.29,53.27 45 top
U$8  10.24,52.46 225 top
U$9  27.78,52.3 135 top
U$10  28.72,53.32 315 top
U$11  34.52,46.55 350 top
U$12  32.38,10.25 90 top
U$13  32.75,5.88 270 top
U$14  28.05,16.49 90 top
U$15  28.88,1.25 0 top
U$16  45.92,13.41 90 top
U$17  10,16.62 90 bottom
U$18  28,35.5 90 top
U$19  16.62,11 0 top
U$20  19,56.01 0 top
U$21  19,54.88 180 top
U$22  12.59,53.56 0 top
U$23  3.18,8.75 270 top
U$24  47.52,10.6 0 top
U$25  27,43.38 270 top
U$26  25.88,43.38 270 top
U$27  48.94,12.16 0 top
U$28  48.29,11.26 0 top
U$29  43.53,11.32 0 top
U$30  44.3,10.62 0 top
U$31  42.85,12.16 180 top
U$32  40.27,40.75 90 bottom
U$33  48.31,47.45 270 top
U$34  40.28,47.45 90 bottom
U$35  40.27,47.45 270 top
U$36  47.51,1.79 0 top
U$37  48.96,3.34 0 top
U$38  48.32,2.43 0 top
U$39  43.62,2.5 0 top
U$40  44.36,1.76 0 top
U$41  42.86,3.35 0 top
U$42  48.33,27.37 270 top
U$43  25.27,56.74 180 top
U$44  48.3,40.74 270 top
U$45  40.28,27.36 90 bottom
U$46  40.28,27.36 270 top
U$47  48.34,20.64 270 top
U$48  40.27,20.65 90 bottom
U$49  40.27,20.65 270 top
U$50  40.27,34.06 270 top
U$51  40.27,34.06 90 bottom
U$52  45.93,1.51 90 top
U$53  5.38,1.38 0 top
U$54  45.92,7.74 90 top
U$55  45.92,10.29 90 top
U$56  45.92,16.53 90 top
U$61  3.5,46.62 10 top
U$62  40.27,40.75 270 top

### Tracks (layer width: path | path; a pad name or v marks a point on that pad's centre or on a via)
+3V3  (via drill 0.3, 0.35, 0.6, 0.75)
  Top 0.15: C21.P$1 8.35,40.62 IC2.8 | R8.P$1 21.76,51.78 R1.P$1
  Top 0.2: U3.4 12.7,7.2 12.88,7.38 | C8.P$2 13.22,12.13 12.88,12.12 11.38,12.12 10.83,11.58 10.83,11.48 R25.P$2 11.38,11.48 R28.P$2 | U$1.P$15 U$1.P$16
  Top 0.3: C7.2 10.03,35.92 C18.P$1 | C7.2 9.75,37.8 IC2.13 | C7.2 9.57,36.38 v8.75,36.38 | IC2.8 8.2,40.62 | IC1.3 16.29,44.54 16.36,44.61 | 18.75,45.44 17.25,45.44 | 16.36,45.44 17.25,45.44 | 16.36,45.44 16.34,45.44 16.34,45.53 15.71,45.53 IC1.1 15.7,45.68 15.64,45.62 | IC1.43 18.75,45.44 | 18.75,45.44 21.44,45.44 21.75,45.74 IC1.37 21.77,46.09 21.84,46.16 | IC1.46 17.25,45.44 | 16.36,44.61 16.36,45.44 | IC1.19 19.25,39.87 18.99,40.12 16.69,40.12 16.36,40.45 16.36,44.01 | 16.36,44.01 16.36,44.61 | IC1.4 16.32,44.04 16.36,44.01
  Top 0.4: U$19.P$15 U$19.P$16 14.35,12.32 v13.97,11.94 13.75,11.72 C8.P$2 | U$1.P$16 20.98,12.2 C9.P$2
  Top 0.5: J2.6 29.68,46.05 34.44,50.81 | 21.81,51.75 R1.P$1 C4.P$2 22.85,51.75 | 21.81,51.75 22.85,51.75 | C1.P$2 13.78,45.62 15.64,45.62 | 22.85,51.75 22.85,49 | 22.85,49 22.85,47.34 21.84,46.33 21.84,46.16 | J3.MP2 22.85,49 | R8.P$1 21.76,51.8 21.81,51.75
  Top 0.6: U$13.+ 34.94,1.44 34.62,1.12 29.8,1.12 U$15.CATHODE 28.8,2.12 28.75,2.12 v26.88,4 | v10,12.25 10.6,12.25 | 10.6,12.25 11.38,11.48 | 12.88,7.38 13.1,7.6 13.1,8.5 13.33,8.28 v13.33,8.26 13.33,8.36 13.08,8.61 13.08,8.95 12.73,9.3 U3.5 | 10.6,12.25 13.1,12.25 C8.P$2 | 8.2,40.62 8.2,42.45 v8.5,42.75 | 9.25,45.75 9.35,45.65 C2.P$2 C3.P$2 C1.P$2
  Top 1.2: U$11.P$2 35.94,49.31 34.44,50.81 v31.12,54.12 31.12,53.89 U$10.P$2 | v8.5,42.75 9.25,43.5 9.25,45.75 9.25,47.75 4.75,52.25 4.75,52.38 | U$61.P$1 2.08,49.71 4.75,52.38 | 4.75,52.38 v6.44,54.06 6.65,54.06 U$7.P$1
  Bottom 0.6: v26.88,4 21.61,9.26 21.61,10.76 20.77,11.6 C9.P$2 20.34,11.57 19.97,11.94 v13.97,11.94 | 10,12.27 v10,12.25 | 10,12.27 9.87,12.4 | 10.57,11.7 10,12.27
  Bottom 0.8: 10.57,11.7 9.87,12.4 5.75,16.52 5.75,38 8.5,40.75 | 10.57,11.7 13.09,9.18 13.09,8.38 13.21,8.26 v13.33,8.26 | J1.6 10.27,11.7 10.57,11.7
  Bottom 1: 20.25,58.25 20.3,58.2 U$20.P$2
  Bottom 1.2: v31.12,54.12 27,58.25 20.25,58.25 10.62,58.25 v6.44,54.06 | 8.5,40.75 v8.5,42.75
  other vias: 20.38,11.6 7.95,9.38 20.3,56.8
  pour Top: 9.75,12.38 12,14.62 14.38,14.62 14.5,14.5 14.5,12 14,11.5 13.38,11.5 13,11.88 13,12 12.25,12 12.12,11.88 12,11.75 12,11.25 10.62,11.25 10.62,11.75 10.38,12 10,12 9.88,12 9.75,12.12
  pour Bottom: 13.62,11.88 14.25,11.25 18.5,11.25 26.25,3.5 26.88,3.5 27.38,4 27.38,4.25 23.25,8.38 23.25,9.62 20.62,12.25 13.75,12.25 13.62,12.12
  pour Bottom: 7.5,9.38 7.75,9.12 12.04,9.12 12.52,8.65 12.52,8.09 12.97,7.63 13.75,7.63 14.04,7.93 14.04,8.77 9.12,13.69 9.12,43.25 6.88,43.25 5.38,41.75 5.38,33.88 5.12,33.62 5.12,16.38 7.5,14
  pour Top: 21.31,50.31 21.38,50.38 21.38,52 21.44,52.06 23.12,52.06 23.19,52 23.19,48.2 21.31,48.2
  pour Top: 13.19,9.6 13.92,8.88 13.92,7.64 13.19,6.91 12.43,6.91 12.41,6.93 12.41,7.34 12.8,7.73 12.8,8.77 12.52,9.06 12.4,9.06 12.27,9.19 12.27,9.61
AD_L1
  Top 0.4: U$62.P$1 42.31,42.05 R54.P$1 42.3,40.68 42.3,39.75 42.57,39.48 Q2.1
AD_L2
  Top 0.4: U$35.P$1 42.33,48.75 R6.P$1 42.25,47.3 42.25,46.55 42.62,46.18 Q5.1
AD_R1
  Top 0.4: U$49.P$1 42.38,21.95 R16.P$1 42.26,20.47 42.26,19.66 42.53,19.38 Q9.1
AD_R2
  Top 0.4: Q7.1 42.51,26.09 42.2,26.4 42.2,27.21 R14.P$1 42.2,28.66 U$46.P$1
ADC1_CH0  (via drill 0.3, 0.35)
  Top 0.2: IC1.5 15.29,43.54 14.59,44.24 v14.59,44.9 | U$9.P$2 26.3,51.47 v26.18,51.35
  Bottom 0.2: v14.59,44.9 14.59,45.42 16.61,47.44 20.85,47.44 21.11,47.18 22.01,47.18 26.18,51.35 v26.18,51.35
ADC1_CH1  (via drill 0.3, 0.35)
  Top 0.2: v30.97,45.17 32.47,45.17 U$6.P$2 | IC1.6 15.03,43.04 v14.42,43.65
  Bottom 0.2: v14.42,43.65 16.62,45.85 29.89,45.85 30.57,45.17 v30.97,45.17
ADC1_CH2  (via drill 0.3, 0.35)
  Top 0.2: v11.82,49.02 11.82,49.04 U$8.P$2 | IC1.7 14.78,42.54 12.52,44.81 v12.46,44.81
  Bottom 0.2: v12.46,44.81 v12.47,44.81 12.47,48.42 11.87,49.02 v11.82,49.02
ADC1_CH6  (via drill 0.3)
  Top 0.2: IC1.10 15.65,41.09 14.65,41.09 13,42.75 v10.75,42.75
  Bottom 0.2: v10.75,42.75 10.74,42.75 9.6,43.89 3.06,43.89 U$5.P$2
  other vias: 2.59,44.36
BATTERY  (via drill 0.3)
  Top 0.15: v15.11,40.54 v15.11,40.55
  Top 0.2: v32.23,12.27 34.17,10.33 R3.P$1 | R3.P$1 | R3.P$1 R2.P$2 | IC1.11 v15.11,40.54
  Bottom 0.15: 31.98,12.53 31.91,12.59
  Bottom 0.2: v15.11,40.55 16.56,39.09 19.86,39.09 21.84,37.12 28.49,37.12 31.91,33.69 31.91,12.59 | 31.98,12.53 v32.23,12.27
BUZZER  (via drill 0.3)
  Top 0.2: v35.25,10.43 35.25,9.28 33,7.03 32.23,7.03 31.15,5.95 Q3.1 | IC1.22 20.75,39.03 21.53,38.26 23.19,38.26 v23.21,38.23
  Top 0.4: R9.P$1 29.25,5.73 29.29,5.76 29.29,5.79 Q3.1
  Bottom 0.15: v35.24,10.43 v35.25,10.43
  Bottom 0.2: v35.24,10.43 35.24,10.66 32.62,13.29 32.62,34.32 28.95,37.99 23.46,37.99 v23.21,38.23
CLK1  (via drill 0.3)  (1 unrouted)
  Top 0.2: IC3.12 44,14.27 v44,14.9
  Bottom 0.2: v44,14.9 44.42,14.48 44.42,10.74 U$30.P$2
CLK2  (via drill 0.3)  (1 unrouted)
  Top 0.2: v44.01,6.2 44.01,5.47 IC5.12
  Bottom 0.2: U$40.P$2 44.48,1.89 44.48,5.73 v44.01,6.2
CS1  (via drill 0.3)  (1 unrouted)
  Top 0.2: v48.76,14.5 48.07,14.5 IC3.5
  Bottom 0.2: U$27.P$2 48.33,12.16 47.82,12.67 47.82,14.23 48.09,14.5 v48.76,14.5
CS2  (via drill 0.3)  (1 unrouted)
  Top 0.2: IC5.5 48.15,5.79 v48.78,5.79
  Bottom 0.2: U$37.P$2 48.46,3.34 47.89,3.91 47.89,5.43 48.25,5.79 v48.78,5.79
EN  (via drill 0.3, 0.35)
  Top 0.15: C5.P$2 19.55,51.67 20.43,51.67 20.46,51.64 20.46,51.69 R1.P$2
  Top 0.2: J3.4 19.8,49.46 v19.77,49.43 | IC1.9 14.71,41.54 13.12,43.13 13.12,43.14 13.08,43.17 12.04,43.17 11.25,43.96 v11.25,44.82
  Top 0.5: J3.4 19.8,51.67 19.88,51.75
  Top 0.6: C5.P$2 19.88,51.75 R1.P$2
  Bottom 0.2: v19.77,49.43 19.71,49.43 15.83,53.31 U$22.P$2 11.26,50.52 v11.26,44.82 v11.25,44.82
  other vias: 14.04,53.31
EN_CLK  (via drill 0.3)
  Top 0.15: 8.88,30.37 8.93,30.43 | 18.25,38.53 v17.72,38 16.58,36.86
  Top 0.2: J1.2 8.5,12.57 8.76,12.83 8.76,13.92 8.37,14.31 8.37,18.31 8.88,18.82 8.88,30.37 | IC1.17 18.25,38.53 16.58,36.86 16.12,36.4 14.77,36.4 8.93,30.57 8.93,30.43 | J2.2 27.57,39.55 23.93,35.91 20.7,35.91 v19.55,37.06 | v14.46,39.75 14.44,39.77 14.34,39.77 13.48,40.62 IC2.23
  Bottom 0.15: 16.21,38 v14.46,39.75
  Bottom 0.2: 16.21,38 v17.72,38 18.61,38 v19.55,37.06 | v14.46,39.75
EN_GN_SSL
  Top 0.15: IC1.12 | 13.36,40.12 14.24,39.24 14.89,39.24
  Top 0.2: IC2.22 13.36,40.12 | 14.89,39.24 IC1.12
EN_GND1  (via drill 0.3)  (1 unrouted)
  Top 0.15: IC3.8 46.7,15.25 47.17,15.25 47.83,15.91 v47.83,16.24
  Bottom 0.2: U$29.P$2 43.53,11.58 43.95,12 43.95,14.05 43.45,14.55 43.45,15.15 43.8,15.5 44.5,15.5 44.78,15.23 47.18,15.23 47.83,15.88 v47.83,16.24
EN_GND2  (via drill 0.3)  (1 unrouted)
  Top 0.15: IC5.8 46.66,6.42 46.87,6.42 47.62,7.17 v47.7,7.17
  Bottom 0.2: U$39.P$2 43.62,2.89 43.9,3.17 43.9,5.52 43.44,5.99 43.44,6.39 43.8,6.75 44.55,6.75 44.92,6.38 46.88,6.38 47.67,7.17 v47.7,7.17
EN_MISO  (via drill 0.3)
  Top 0.15: 17.9,37.24 v17.86,37.24 | IC2.9 9.19,40.13 9.73,40.13 | 9.85,40.94 9.84,40.93 9.84,40.25 | 14.4,38.68 13.44,39.63 12.65,39.63
  Top 0.2: J1.3 8.55,11.78 9.12,12.35 9.12,14.29 8.75,14.66 8.75,18.12 9.25,18.62 9.25,30.33 14.84,35.92 16.55,35.92 v17.86,37.24 | J2.3 27.64,40.35 23.78,36.49 23.24,36.49 v23.24,36.48 | IC2.9 9.72,40.12 9.73,40.13 9.84,40.25 9.85,40.26 9.85,40.94 10.03,41.12 12.25,41.12 12.38,40.99 12.38,39.9 12.65,39.63 | 14.4,38.68 v14.4,38.63 | IC1.18 18.75,38.08 17.9,37.24
  Bottom 0.2: v23.24,36.48 18.64,36.48 17.89,37.24 v17.86,37.24 15.81,37.24 14.5,38.55 14.48,38.55 v14.4,38.63
EN_MOSI  (via drill 0.3)
  Top 0.2: J1.4 8.35,10.97 9.47,12.09 9.47,14.65 9.09,15.03 9.09,17.84 9.62,18.38 9.62,30.06 15.05,35.48 17.21,35.48 19.76,38.03 v19.76,38.04 | v19.76,38.04 IC1.20 | J2.4 27.72,41.15 23.65,37.08 20.75,37.08 19.79,38.04 v19.76,38.04 | IC2.24 13.84,41.12 14.18,40.78 v14.18,40.7
  Bottom 0.15: 16.36,38.57 14.23,40.7
  Bottom 0.2: v19.76,38.04 19.23,38.57 16.36,38.57 | v14.18,40.7 14.23,40.7
EN_SSL_L
  Top 0.15: 8.55,21.16 8.55,21.09
  Top 0.2: IC1.16 17.75,38.85 15.73,36.83 14.63,36.83 8.55,30.75 8.55,21.16 | 8.55,21.09 8.55,19.17 7.95,18.57 J1.1
EN_SSL_R  (via drill 0.35)
  Top 0.2: v23.36,44.56 22.32,44.56 IC1.34 | J2.1 30.29,38.75 30.96,39.42 v30.96,41.37
  Bottom 0.2: v30.96,41.37 27.77,44.56 v23.36,44.56
GND  (via drill 0.3, 0.35, 0.6, 1.5)
  Top 0.15: 23.82,57.76 23.34,58.25
  Top 0.2: 29.45,10.75 Q1.2
  Top 0.3: J1.5 8.69,10.18 9.38,10.86 10,10.86 | 10,10.86 12.64,10.86 | 12.64,10.86 13.29,10.86 C8.P$1 | C26.P$2 10,10.87 10,10.86 | R36.P$1 12.64,11.46 12.64,10.86 | IC2.11 10.38,39.12 IC2.P$1 | C1.P$1 13.75,47.25
  Top 0.4: U$19.P$12 U$19.P$5 16.95,5.47 C11.2 | C8.P$1 13.62,10.4 14.35,9.68 U$19.P$1 14.35,6.79 v14.38,6.79 | C9.P$1 20.5,10.4 20.98,9.93 U$1.P$1 20.98,6.97 v20.62,6.62 | U$1.P$12 U$1.P$5 23.57,5.72 C12.2 | 9.5,8.25 U3.9 11.95,7.92 U3.3 11.95,5.4 U$53.P$5 U$53.P$6 | J1.MP2 6.72,8.25 9.5,8.25 | C10.2 9.5,8.25 | R9.P$2 28.1,4.62 v29.38,4.62 29.44,4.56 29.44,4.06 Q3.2 | v29.38,9.5 29.23,9.5 R10.P$2 29.45,9.72 29.45,10.75 | R3.P$2 32.17,11.17 29.67,11.17 Q1.2
  Top 0.5: U$2.P$2 5.88,13.38 v6.55,13.38 | J1.5 6.62,10.18 6.55,10.25 | J2.5 28.93,41.95 28,42.88 U$25.P$2 | v31.84,51.34 31.71,51.34 29,48.62 29,43.5 28.38,42.88 U$25.P$2 | U$26.P$2 U$25.P$2 | 17.25,51.75 17.4,51.6 J3.1 17.4,49.71 16.69,49 J3.MP1 | C4.P$1 25.15,52.84 25.15,58.02 | U$43.P$2 23.82,57.76
  Top 0.6: J1.MP1 5.65,15.58 5.65,40.5 6,40.5 | C2.P$1 C3.P$1 C1.P$1 | C6.P$1 C5.P$1 17.25,51.75 16,51.75 | 13.75,47.25 13.75,49.5 16,51.75 | 16,51.75 16,58.25 | U$22.P$1 14.04,58.17 14.12,58.25
  Top 1: 4.88,47.88 U$61.P$2 | U$20.P$1 17.7,58.16
  Top 1.2: J1.MP1 v6.55,13.38 6.55,10.25 J1.MP2 | U$10.P$1 25.15,58.02 24.93,58.25 23.34,58.25 21.14,58.25 21.1,58.28 17.82,58.28 17.7,58.16 17.61,58.25 16,58.25 14.12,58.25 13.14,58.25 U$7.P$2 | 6,40.5 6,42.88 6.75,43.62 6.75,47 5.88,47.88 4.88,47.88
  Bottom 0.4: v20.62,6.62 14.58,6.62 14.42,6.79 v14.38,6.79
  Bottom 1.2: 21.5,2 17.25,2 15.38,3.88 C11.2 14.25,3.88 11,7.12 8.25,7.12 6.55,8.82 v6.55,13.38 4.55,11.38 2.12,11.38 1.14,10.39 1.14,2.99 2.12,2 U$3.P$1 | 21.5,2 26.75,2 v29.38,4.62 v29.38,9.5 | C12.2 21.73,2.23 21.5,2 | U$10.P$1 v31.84,51.34 33.38,49.8 U$11.P$1 | U$7.P$2 4.64,49.75 U$61.P$2 | IC2.P$1 13.25,42 17.66,42 IC1.49
  other vias: 11.62,8.25 4.64,47.64 9.64,54.75 33.38,47.57 28.37,54.81 18.99,42.81
  pour Bottom: 3.4,2.61 2.27,2.61 1.88,3 1.88,7.88 3.62,9.62 5,9.62 8,6.62 10.62,6.62 16.62,0.62 27.62,0.62 31.25,4.25 31.25,9.75 30.62,10.38 29,10.38 28.62,10 28.62,4.88 26.38,2.62 23.75,2.62 21.88,4.5 21.62,4.5 19.75,2.62 17.5,2.62 15.62,4.5 14.12,4.5 11,7.62 8.5,7.62 7.12,9 7.12,13.75 7,13.88 1.75,13.88 0.06,12.19 0.06,2.56 1.5,1.12 2.88,1.12 3.4,1.65
  pour Top: 16.75,13.62 16.75,13.12 16.62,13 16.38,12.75 16.38,10.38 16.38,9.25 16.75,8.88 16.75,7.38 16.75,7.12 16.5,6.88 14.62,5 14.62,4.38 14.62,3.75 15,3.38 15.5,3.38 17.12,5 17.12,8.75 17.5,9.12 17.62,9.25 17.62,12.75 17.12,13.25 17.12,13.62
  pour Top: 23.38,13.38 23.38,13 22.75,12.38 22.75,9.25 23.38,8.62 23.38,7.12 21,4.75 21,3.62 21.38,3.25 21.75,3.25 23.75,5.25 23.75,8.62 24.38,9.25 24.38,12.38 23.75,13 23.75,13.38
  pour Top: 5.38,43 5.38,12.62 5.5,12.5 7.12,12.5 7.12,14 7.25,14.12 7.38,14.12 7.62,14.38 7.62,18.75 8.25,19.38 8.25,30.88 12.75,35.38 12.75,38.5 12.12,39.12 12.12,40.62 11.88,40.88 10.25,40.88 10.12,40.75 10.12,40.12 9.25,39.25 7.5,39.25 7.5,47.12 6,48.62 4.38,48.62 4.12,48.38 4.12,47.12 4.38,46.88 5.12,46.88 5.25,47 5.75,47 6.12,46.62 6.12,43.75
  pour Bottom: 11.75,42.62 14.88,42.62 17.25,45 20.62,45 21.25,44.38 21.25,41.2 13.94,41.2 11.5,38.76 10.12,38.76 10,38.88 10,40.88
  pour Top: 16.75,48.19 13.56,48.19 13.56,49.56 13.75,49.75 15.69,51.69 17,51.69 17.56,51.69 17.75,51.5 17.75,49.19
GND2  (via drill 0.35)
  Top 0.4: R54.P$2 43.12,40.17 43.7,40.75 v44.1,40.75 44.57,40.75 Q4.2
  Bottom 0.4: U$32.P$1 42.4,39.45 43.7,40.75 v44.1,40.75 48.43,40.75 49.88,39.3 C13.2
  other vias: 49.88,39.14
GND3  (via drill 0.35)
  Top 0.4: R6.P$2 43.07,46.86 43.66,47.45 v44.05,47.45 44.55,47.45 Q6.2
  Bottom 0.4: U$34.P$1 42.35,46.15 43.65,47.45 v44.05,47.45 48.41,47.45 49.87,45.99 C14.2
  other vias: 49.87,45.85
GND4  (via drill 0.35)
  Top 0.4: R14.P$2 43.03,26.73 43.65,27.35 v44.05,27.35 44.57,27.35 Q8.2
  Bottom 0.4: C15.2 49.89,25.93 48.46,27.35 46.5,27.35 | 46.5,27.35 v44.05,27.35 | 46.5,27.35 46.5,28.3 45.22,29.58 42,29.58 U$45.P$2
  other vias: 49.89,25.76
GND5  (via drill 0.35)
  Top 0.4: R16.P$2 43.65,20.65 v44.05,20.65 44.52,20.65 Q10.2
  Bottom 0.4: C16.2 48.38,20.65 46.35,20.65 | 46.35,20.65 v44.05,20.65 | U$48.P$2 41.8,21.95 42.7,22.86 45.2,22.86 46.35,21.7 46.35,20.65
  other vias: 49.97,19.07
IO0_LED2  (via drill 0.3)
  Top 0.15: J3.5 20.6,50.66
  Top 0.2: IC1.23 21.25,39.15 21.62,38.78 24.71,38.78 25.85,39.92 25.85,41.4 25.15,42.11 25.15,45.91 25.47,46.23 R23.P$2 26.48,45.62 27.52,45.62 27.83,45.93 v27.83,49.47 v27.84,49.48 | 20.6,50.66 21.08,51.13 21.08,52.22 20.67,52.62 C6.P$2 18.94,53.16 v18.94,54.1
  Bottom 0.2: v27.84,49.48 27.84,50.98 24.58,54.24 19.08,54.24 v18.94,54.1
L_IN1  (via drill 0.3)
  Top 0.2: U$1.P$2 v21.62,12.25 | v24.48,39.61 24.48,39.68 22.6,41.56 22.32,41.56 IC1.28 | v28.88,18.78 30.52,18.78 32.26,20.52 32.26,38.05 31.74,38.58 v31.7,38.53
  Bottom 0.2: v21.62,12.25 21.62,13.13 27.28,18.78 v28.88,18.78 | v24.48,39.61 25.3,38.79 31.41,38.79 31.67,38.53 v31.7,38.53
L_IN2  (via drill 0.3)
  Top 0.2: U$1.P$3 v22.27,11.56 | v25.08,40.1 23.13,42.04 IC1.29 | v29.5,18.25 30.75,18.25 32.62,20.12 32.62,38.75 v32.23,39.15
  Bottom 0.2: v22.27,11.56 22.27,13.07 27.39,18.19 29.44,18.19 v29.5,18.25 | v25.08,40.1 25.95,39.23 32.15,39.23 v32.23,39.15
L_PWM  (via drill 0.3)
  Top 0.15: 31.93,20.88 31.93,20.91
  Top 0.2: U$1.P$14 22.27,14.89 22.6,15.21 v22.61,15.21 | 31.93,20.88 30.42,19.38 v28.25,19.38 | v23.01,39.31 21.93,39.31 IC1.24 | v31.56,36.3 31.93,35.94 31.93,20.91
  Bottom 0.2: v28.25,19.38 26.78,19.38 v22.61,15.21 | v31.56,36.3 v31.55,36.3 29.48,38.38 24.58,38.38 23.65,39.31 v23.01,39.31
LED_1
  Top 0.2: IC1.35 23.04,45.04 24.77,46.78 26.45,46.78 R24.P$2
LED_L1
  Top 0.4: U$62.P$2 41.99,38.54 45.58,38.54 R5.P$1
LED_L2
  Top 0.4: U$35.P$2 41.97,45.25 45.67,45.25 R11.P$1
LED_R1
  Top 0.4: U$49.P$2 41.2,19.35 42.1,18.45 45.56,18.45 R17.P$1
LED_R2
  Top 0.4: U$46.P$2 41.99,25.15 45.7,25.15 R15.P$1
MISO1  (via drill 0.3)  (1 unrouted)
  Top 0.2: IC3.7 47.1,14.95 47.8,14.95 v48.35,15.5
  Bottom 0.2: v48.35,15.5 47.39,14.54 47.39,12.16 U$28.P$2
MISO2  (via drill 0.3)  (1 unrouted)
  Top 0.2: v48.26,6.66 47.74,6.15 47.09,6.15 IC5.7
  Bottom 0.2: U$38.P$2 47.43,3.32 47.43,5.83 v48.26,6.66
MOSI1  (1 unrouted)
  Top 0.2: U$24.P$2 47.52,11.71 47.92,12.11 47.92,12.47 IC3.4
MOSI2  (1 unrouted)
  Top 0.2: U$36.P$2 47.51,2.82 47.94,3.25 47.94,3.67 IC5.4
N$1  (via drill 0.6)
  Top 0.4: U$19.P$6 U$19.P$7 v17.96,8.34
  Bottom 1.2: U$17.P$1 10,14.07 15.73,8.34 v17.96,8.34
N$2
  Top 0.4: U$19.P$11 17.92,13.95 U$19.P$10
  Top 1.2: 17.92,13.95 17.92,14.96 16.5,16.38 11.87,16.38 10.88,17.38 U$17.P$2
N$3
  Top 0.15: Q3.3 31.77,5
  Top 0.6: U$13.- 32.9,6.12 31.77,5 U$15.ANODE
N$4
  Top 0.5: U$2.P$1 R4.P$2
N$5
  Top 0.3: C22.P$1 IC2.10
N$6
  Top 0.4: U$44.CASODE 47.63,40.14 Q4.3
N$7
  Top 0.4: R5.P$2 47.09,39.76 45.53,41.32 Q4.1
N$8
  Top 0.4: C14.1 48.64,49.05 U$33.ANODE 47.48,49.55 R13.P$1
N$9  (via drill 0.6)
  Top 0.4: U$1.P$6 U$1.P$7 v24.5,8.3
  Bottom 1.2: U$18.P$1 28.88,33.88 28.88,20.75 30.65,18.98 30.65,14.45 v24.5,8.3
N$10
  Top 0.4: U$1.P$11 24.52,13.82 U$1.P$10
  Top 1.2: U$18.P$2 27.25,36.25 26.62,35.62 26.62,34.01 28.88,31.75 28.88,21.75 24.52,17.4 24.52,13.82
N$11
  Top 0.4: Q6.3 47.59,46.91 U$33.CASODE
N$12
  Top 0.4: R11.P$2 47.08,46.42 45.48,48.02 Q6.1
N$13
  Top 0.4: R18.P$1 47.58,29.38 U$42.ANODE 48.65,28.96 C15.1
N$14
  Top 0.4: U$42.CASODE 48.33,26.64 Q8.3
N$15  (via drill 0.35)
  Top 0.2: R7.P$1 v2.63,5.65 | v2.25,9.95 U$23.G
  Top 0.4: U$53.P$7 5.53,4.42 4.3,5.65 v2.63,5.65
  Bottom 0.2: v2.63,5.65 2.63,9.58 v2.25,9.95
N$16
  Top 0.4: R15.P$2 47.14,26.26 45.47,27.93 Q8.1
N$17
  Top 1.2: U$3.P$2 1.4,4.85 R7.P$2 1.4,6.7
  pour Top: 3.38,3.38 3.38,3.88 2.12,5.12 2.12,6.25 2.63,6.75 2.63,8.48 2.6,8.5 1.38,8.5 0.12,7.25 0.12,3.31 0.56,2.88 2.88,2.88
N$18
  Top 0.4: C16.1 48.7,22.27 U$47.ANODE 47.54,22.72 R19.P$1
N$19
  Top 0.4: U$47.CASODE 48.34,19.88 Q10.3
N$20
  Top 0.4: R17.P$2 47.13,19.67 45.47,21.34 Q10.1
N$21
  Top 0.3: IC4.5 45.34,33.26 44.83,33.77 R22.P$2
N$22
  Top 0.3: R26.P$2 44.73,34.58 45.01,34.86 IC4.7
N$23
  Top 0.5: U$52.P$1 U$4.P$1
N$24
  Top 0.5: U$4.P$2 U$54.P$1
N$25
  Top 0.5: U$55.P$1 U$16.P$1
N$26
  Top 0.2: U3.8 10,9.95 C26.P$1
N$27
  Top 0.5: U$16.P$2 U$56.P$1
N$28
  Top 0.2: U3.6 11.95,10.07 R28.P$1
  Top 0.6: R28.P$1 R36.P$2
N$31
  Top 0.2: R25.P$1 10.74,10.14 11.3,9.57 U3.7
N$35
  Top 0.5: R23.P$1 U$26.P$1
N$36
  Top 0.5: R24.P$1 U$25.P$1
N$76
  Top 0.4: C13.1 48.63,42.34 U$44.ANODE 47.47,42.84 R12.P$1
N$102
  Top 0.15: Q1.3 28.5,13.15
  Top 0.2: 31.38,13.15 U$12.ANODE
  Top 1.2: U$14.P$1 28.38,15.41 28.38,13.18 Q1.3 | 28.5,13.15 31.38,13.15
R_IN1  (via drill 0.3)
  Top 0.15: 16.25,39.27 IC1.13
  Top 0.2: v15.04,12.74 15,12.7 U$19.P$2 | v13.32,37.84 13.59,38.1 15.08,38.1 16.25,39.27
  Bottom 0.2: v15.04,12.74 15,12.78 15,13.77 8.87,19.89 8.87,33.38 v13.32,37.84
R_IN2  (via drill 0.3)
  Top 0.2: IC1.14 16.75,39.18 15.24,37.67 13.93,37.67 v13.3,37.04 | U$19.P$3 15.65,12.5 v15.88,12.73
  Bottom 0.2: v15.88,12.73 15.88,13.55 9.25,20.18 9.25,32.99 v13.3,37.04
R_PWM  (via drill 0.3)
  Top 0.2: U$19.P$14 15.65,15.28 v15.68,15.31 | v13.24,36.21 14.32,37.29 15.35,37.29 17.25,39.19 IC1.15
  Bottom 0.15: 9.62,22.11 9.62,22.13
  Bottom 0.2: 9.62,22.11 9.62,21.34 15.66,15.31 v15.68,15.31 | 9.62,22.13 9.62,32.59 v13.24,36.21
RXD
  Top 0.2: J3.3 19,49.33 20.25,48.08 IC1.40
SEN_FRONT  (via drill 0.3)
  Top 0.2: IC1.36 22.75,45.54 24.58,47.37 v26.64,47.37
  Bottom 0.2: U$5.P$1 9.44,49.1 9.44,51.08 13.08,54.73 24.93,54.73 28.62,51.03 28.62,49.35 v26.64,47.37 30,47.37 33.04,44.34 U$6.P$1
  other vias: 5.15,44.81 35.41,44.34
SEN_LS  (via drill 0.35)
  Top 0.2: IC1.42 19.25,46.37 19.22,46.4 v19.22,46.86 19.2,46.88 16.06,46.88 15.39,46.22 11.21,46.22 10.95,46.47 10.95,47.17 12.77,48.99 12.77,51.77 U$8.P$1 | v23.86,48.15 26.21,50.51 27.82,50.51 U$9.P$1
  Bottom 0.2: 22.56,46.86 23.4,47.71 23.41,47.71 v23.86,48.15 22.57,46.86 22.56,46.86 | v19.22,46.86 19.27,46.81 22.51,46.81 22.55,46.86 22.56,46.86
SUCTION_PWM  (via drill 0.3)
  Top 0.15: 27.55,10.97 27.55,10.1
  Top 0.2: v30.67,11.9 28.48,11.9 27.55,10.97 | v22.27,37.65 v22.26,37.65 21.48,37.65 20.25,38.88 IC1.21
  Top 0.4: R10.P$1 27.55,9.72 27.55,10.1 Q1.1
  Bottom 0.2: v22.27,37.65 22.38,37.65 22.46,37.58 28.68,37.58 32.25,34 32.25,13.02 32.77,12.5 32.77,11.96 32.54,11.73 30.85,11.73 v30.68,11.9 v30.67,11.9
SW1  (via drill 0.35)
  Top 0.2: v12.48,43.82 12.5,43.83 12.91,43.83 14.71,42.04 IC1.8
  Top 0.5: R8.P$2 23.81,53.49 U$43.P$1
  Bottom 0.2: v12.48,43.82 11.09,43.82 10.56,44.35 10.56,51.44 12.99,53.87 18.26,53.87 18.57,53.56 19.39,53.56 19.66,53.83 23.48,53.83 U$43.P$1
  other vias: 23.82,53.49
T_GND  (via drill 0.35)
  Top 0.5: C19.P$1 v42.9,31.94 C17.P$1 41.1,32.79 U$50.P$2 | IC4.6 46.7,34.06 | 46.7,34.06 47.45,34.06 | 47.45,34.06 48.1,34.06 | 48.1,34.06 IC4.12 | IC4.4 46.66,34.01 46.7,34.06 | 47.45,34.06 47.46,34.05 IC4.3 v47.46,32.61 v47.45,32.6 | IC4.2 48.26,33.9 48.1,34.06
  Bottom 0.5: v47.45,32.6 43.56,32.6 v42.9,31.94
T_SCL  (via drill 0.35)
  Top 0.3: IC4.10 48.26,35.74 47.85,36.15 v45.06,36.15 R21.P$2
  Bottom 0.3: v45.06,36.15 43.05,36.15 42.27,35.37 U$51.P$2
T_SDA  (via drill 0.35)
  Top 0.3: IC4.9 47.46,35.04 47.08,35.42 44.59,35.42 v44.55,35.38 R20.P$2
  Bottom 0.3: v44.55,35.38 43.52,34.35 42.15,34.35 41.07,33.27 U$51.P$1
T_VDD
  Top 0.2: C17.P$2 43.88,32.79 R22.P$1
  Top 0.3: IC4.1 49.1,32.8 48.15,31.85 44.17,31.85 C19.P$2
  Top 0.5: R21.P$1 R20.P$1 | R20.P$1 R26.P$1 R22.P$1 | C17.P$2 C19.P$2 | U$50.P$1 42.89,35.36 R20.P$1 | IC4.11 49.64,34.86 50,34.5 50,33.6 49.65,33.25 IC4.1
TOF_SDA  (via drill 0.3, 0.35)
  Top 0.2: IC1.38 21.25,47.31 21.58,47.64 v21.58,47.72 | U$21.P$1 20.3,53.24 v20.28,53.22
  Bottom 0.2: v21.58,47.72 21.61,47.72 21.73,47.84 21.73,51.78 v20.28,53.22
TOF_SDI  (via drill 0.3, 0.35)
  Top 0.2: IC1.39 v20.75,49.36 v20.76,49.37 | v17.38,52.89 17.38,53.75 U$21.P$2
  Bottom 0.2: v20.76,49.37 20.73,49.39 20.73,49.53 v17.38,52.89
TXD
  Top 0.2: IC1.41 19.8,46.14 19.8,47.9 18.2,49.5 J3.2
VCC  (via drill 1)
  Top 0.152: 31.48,9.22 32.89,9.22 R2.P$1
  Top 0.2: 17.89,3.65 C11.1 | U$19.P$9 18.9,12.47 19.25,12.12 | U$23.D4 4.55,7.99 v4.55,8.7 | 4.16,9.87 4.55,9.48 v4.55,8.7 | v4.55,8.7 5.25,9.4
  Top 0.4: U$1.P$9 U$1.P$8 25.52,5.13 24.32,3.93 C12.1 | 18.9,4.88 U$19.P$8 | U3.1 U3.2 9.85,5.75 8.22,5.75
  Top 0.5: 5.25,9.4 R4.P$1 5.07,9.95 U$23.D1 | 5.25,9.4 | U$23.D1 U$23.D2 U$23.D3 U$23.D4 | U$23.D1 4.16,9.87 | U$23.D4 U$23.D1 | U$23.D4 5.25,8.69 5.25,9.4
  Top 1.2: 24.32,3.93 24.32,3.9 26,5.58 26,7.88 | U$14.P$2 27.24,17.24 26,16 26,7.88 | C11.1 18.9,4.88 | 18.9,4.88 19.25,5.22 19.25,12.12 | U$12.CATHODE 31.48,9.22 30.12,7.88 26,7.88 | v13.88,1.62 15.75,1.62 16.12,2 16.24,2 | 16.24,2 17.89,3.65 | 16.24,2 22.88,2 24.27,3.4 C12.1 | v7.5,5.75 8.22,5.75
  Bottom 1.2: v4.55,8.7 v7.5,5.75 7.55,5.7 10.11,5.7 13.88,1.94 v13.88,1.62
  pour Top: 6.88,5.62 7.38,5.12 9.88,5.12 11.62,6.88 11.62,7.5 8.38,7.5 6.88,6
  pour Bottom: 4,9.25 3.5,8.75 3.5,7.62 3.5,6.12 6.12,3.5 10.5,3.5 12.5,1.5 13.25,0.75 14.12,0.75 14.62,1.25 14.62,2 10.38,6.25 7.88,6.25 4.88,9.25
  pour Top: 13.62,2.62 13.06,2.06 13.06,1.19 13.5,0.75 22.75,0.75 26.88,4.88 26.88,5.88 28,7 31.38,7 33.38,9 33.38,9.5 33.12,9.75 32.75,9.75 31.88,10.62 31.12,10.62 29.25,8.75 27.5,8.75 27,9.25 27,15.88 27.88,16.75 27.88,17.88 27.62,18.12 27.12,18.12 25.38,16.38 25.38,6.38 23.38,4.38 23.38,3.38 22.75,2.75 20.88,2.75 19.88,3.75 19.88,14.38 19.5,14.75 18.75,14.75 18.62,14.62 18.62,6 17,4.38 17,3.76 15.87,2.62
  pour Top: 2.92,10.7 2.92,6.78 4.4,6.78 5.57,7.95 5.57,9.66 4.53,10.7
VCC2
  Top 0.4: Q2.2 44.9,42.84 R12.P$2
  Bottom 0.4: Q2.2 41.1,42.02 U$32.P$2
VCC3
  Top 0.4: R13.P$2 44.9,49.55 Q5.2
  Bottom 0.4: Q5.2 41.11,48.72 U$34.P$2
VCC4
  Top 0.4: Q7.2 44.81,29.38 R18.P$2
  Bottom 0.4: Q7.2 41.49,26.06 U$45.P$1
VCC5
  Top 0.4: R19.P$2 44.86,22.72 Q9.2
  Bottom 0.4: Q9.2 41.49,19.35 U$48.P$1
VDD1  (1 unrouted)
  Top 0.2: IC3.13 43.6,12.16 U$31.P$2
VDD2  (1 unrouted)
  Top 0.2: U$41.P$2 43.58,3.35 IC5.13